# EAGLE schematic p8x-regbank-card (EAGLE 9.6.2)
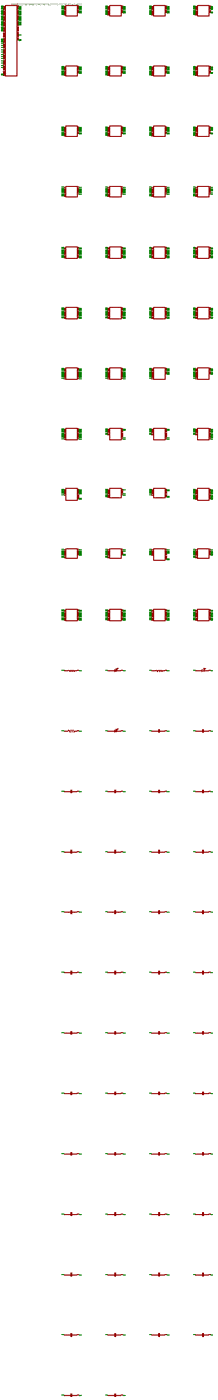
[diagram p0: schematic, sheet 1, overview]
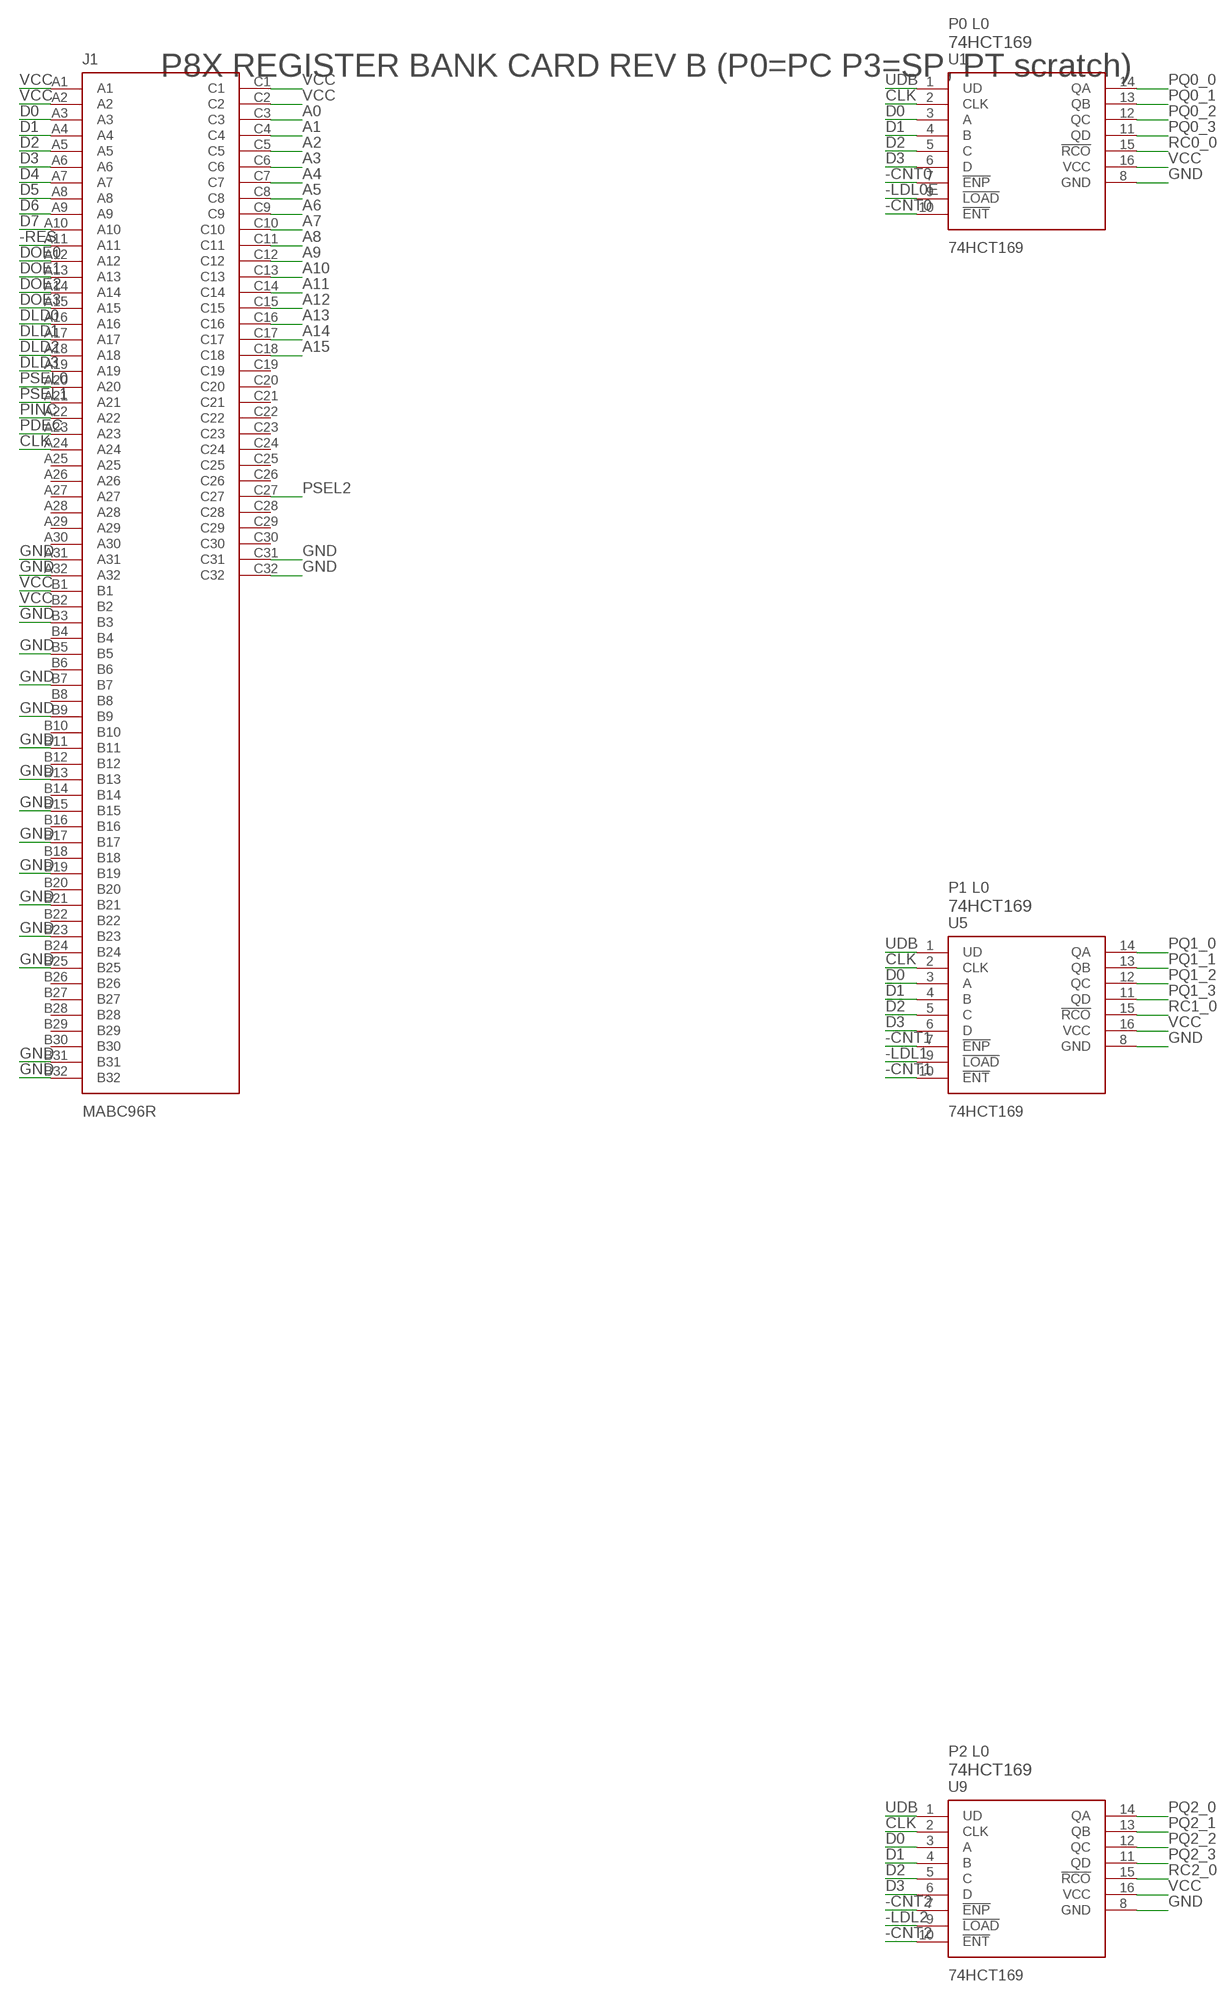
[diagram p1: schematic, sheet 1, part 1 of 9]
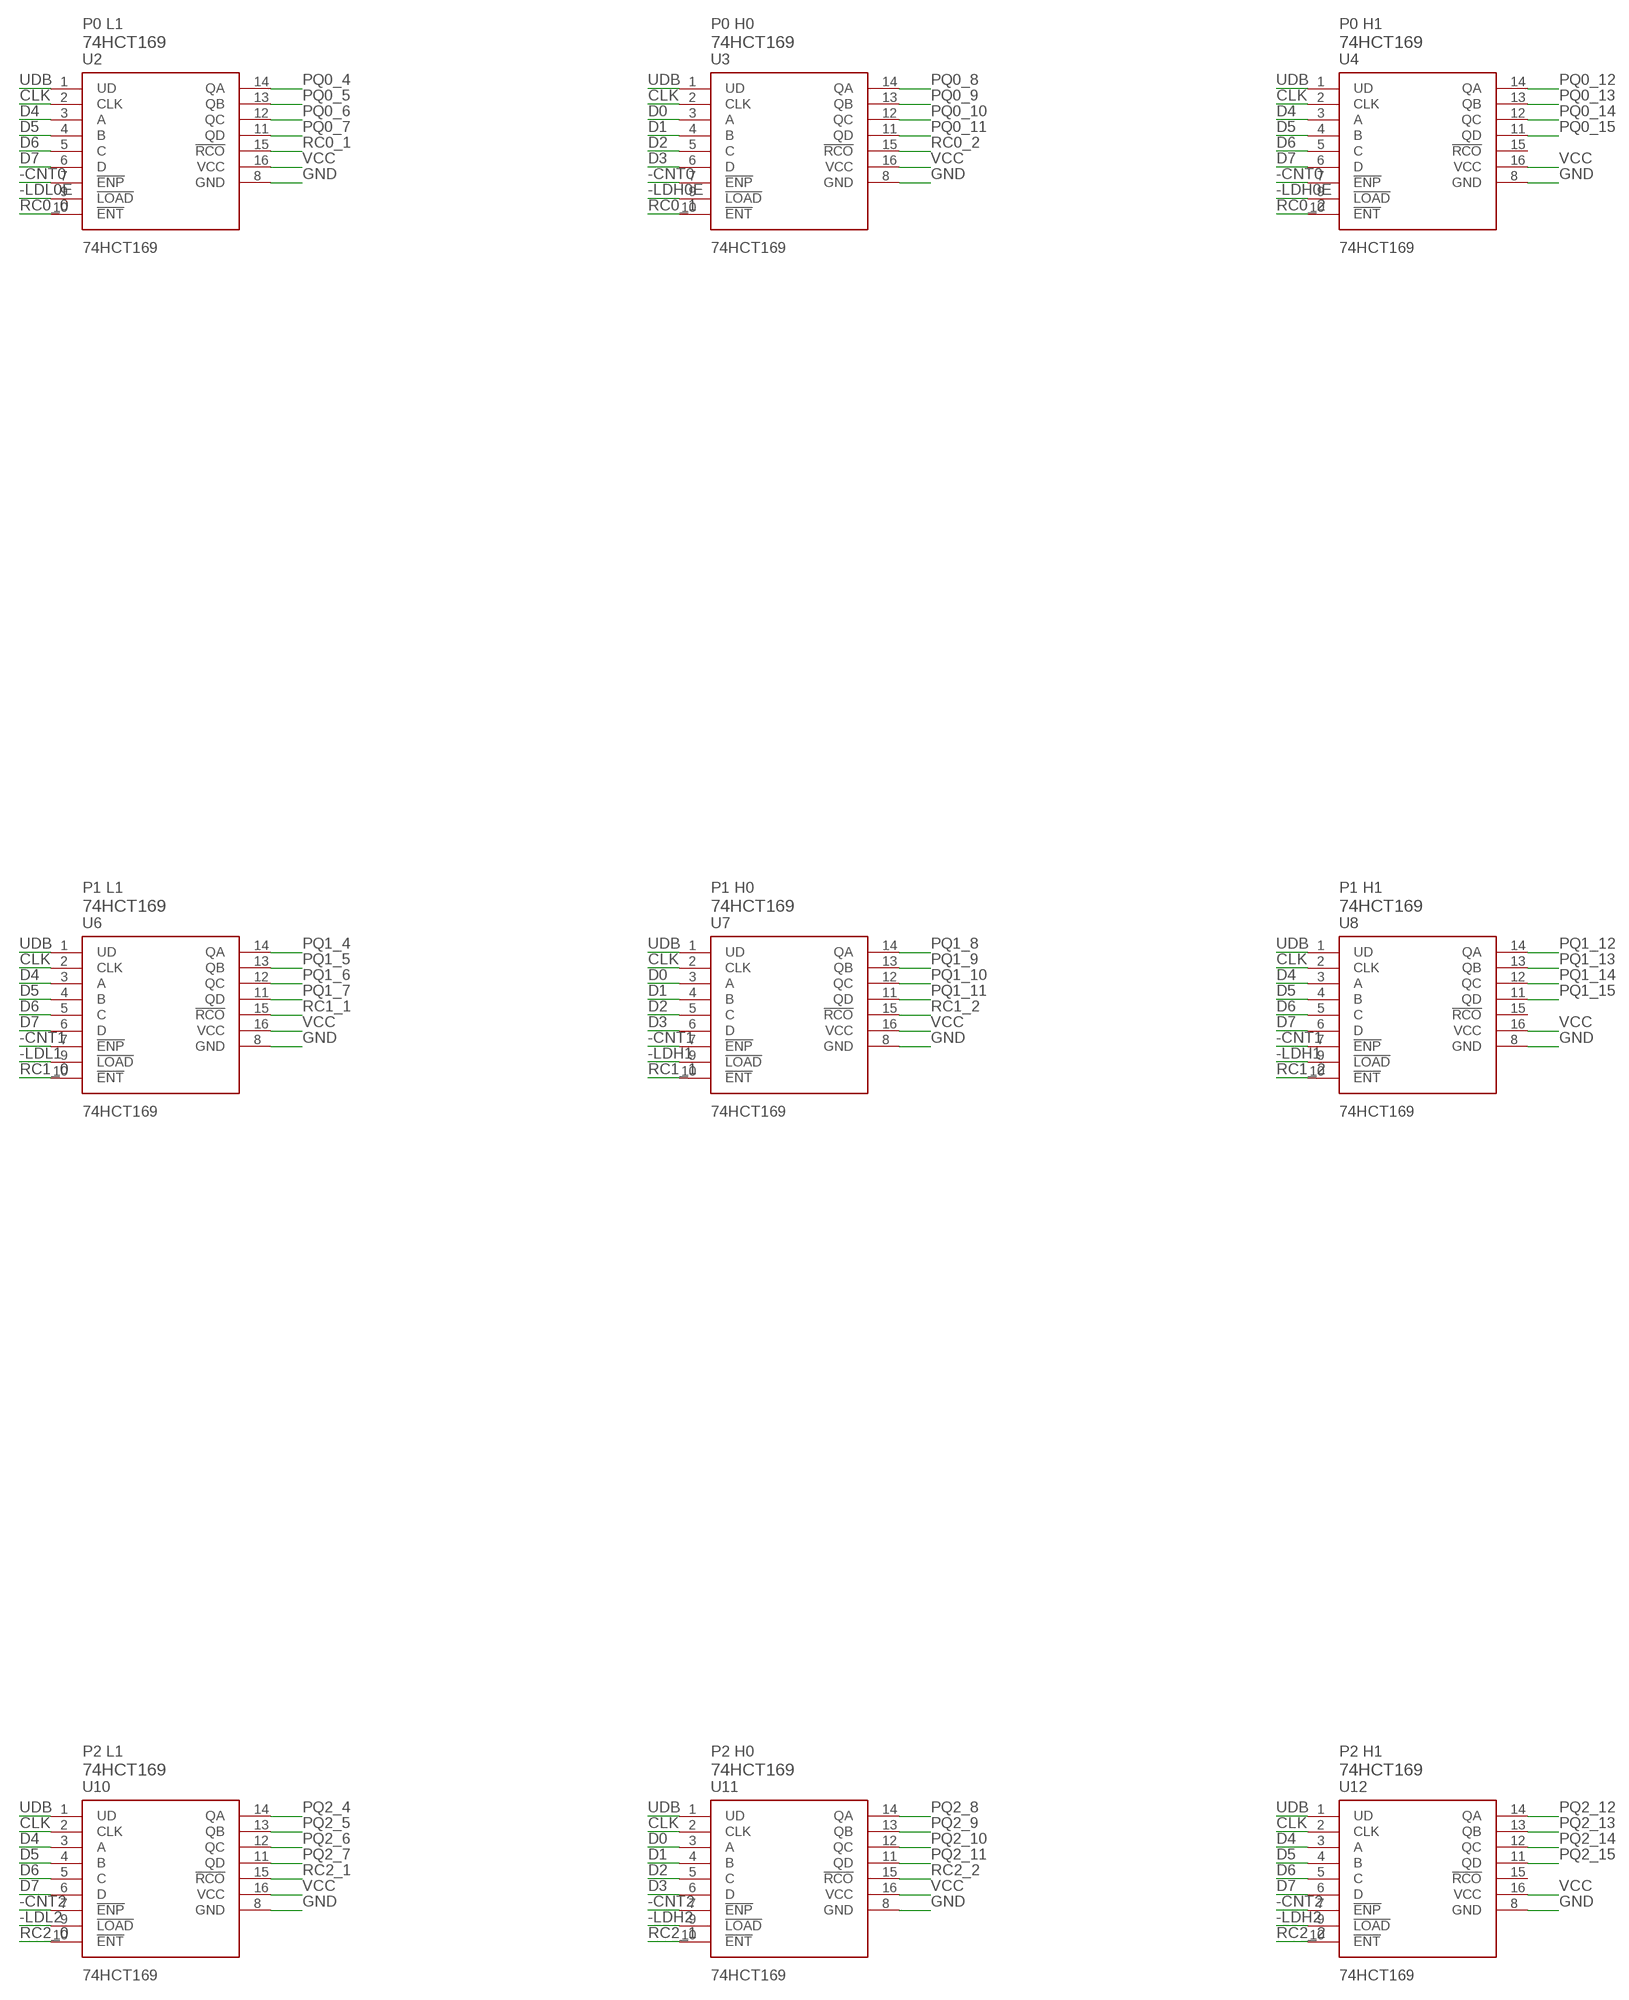
[diagram p2: schematic, sheet 1, part 2 of 9]
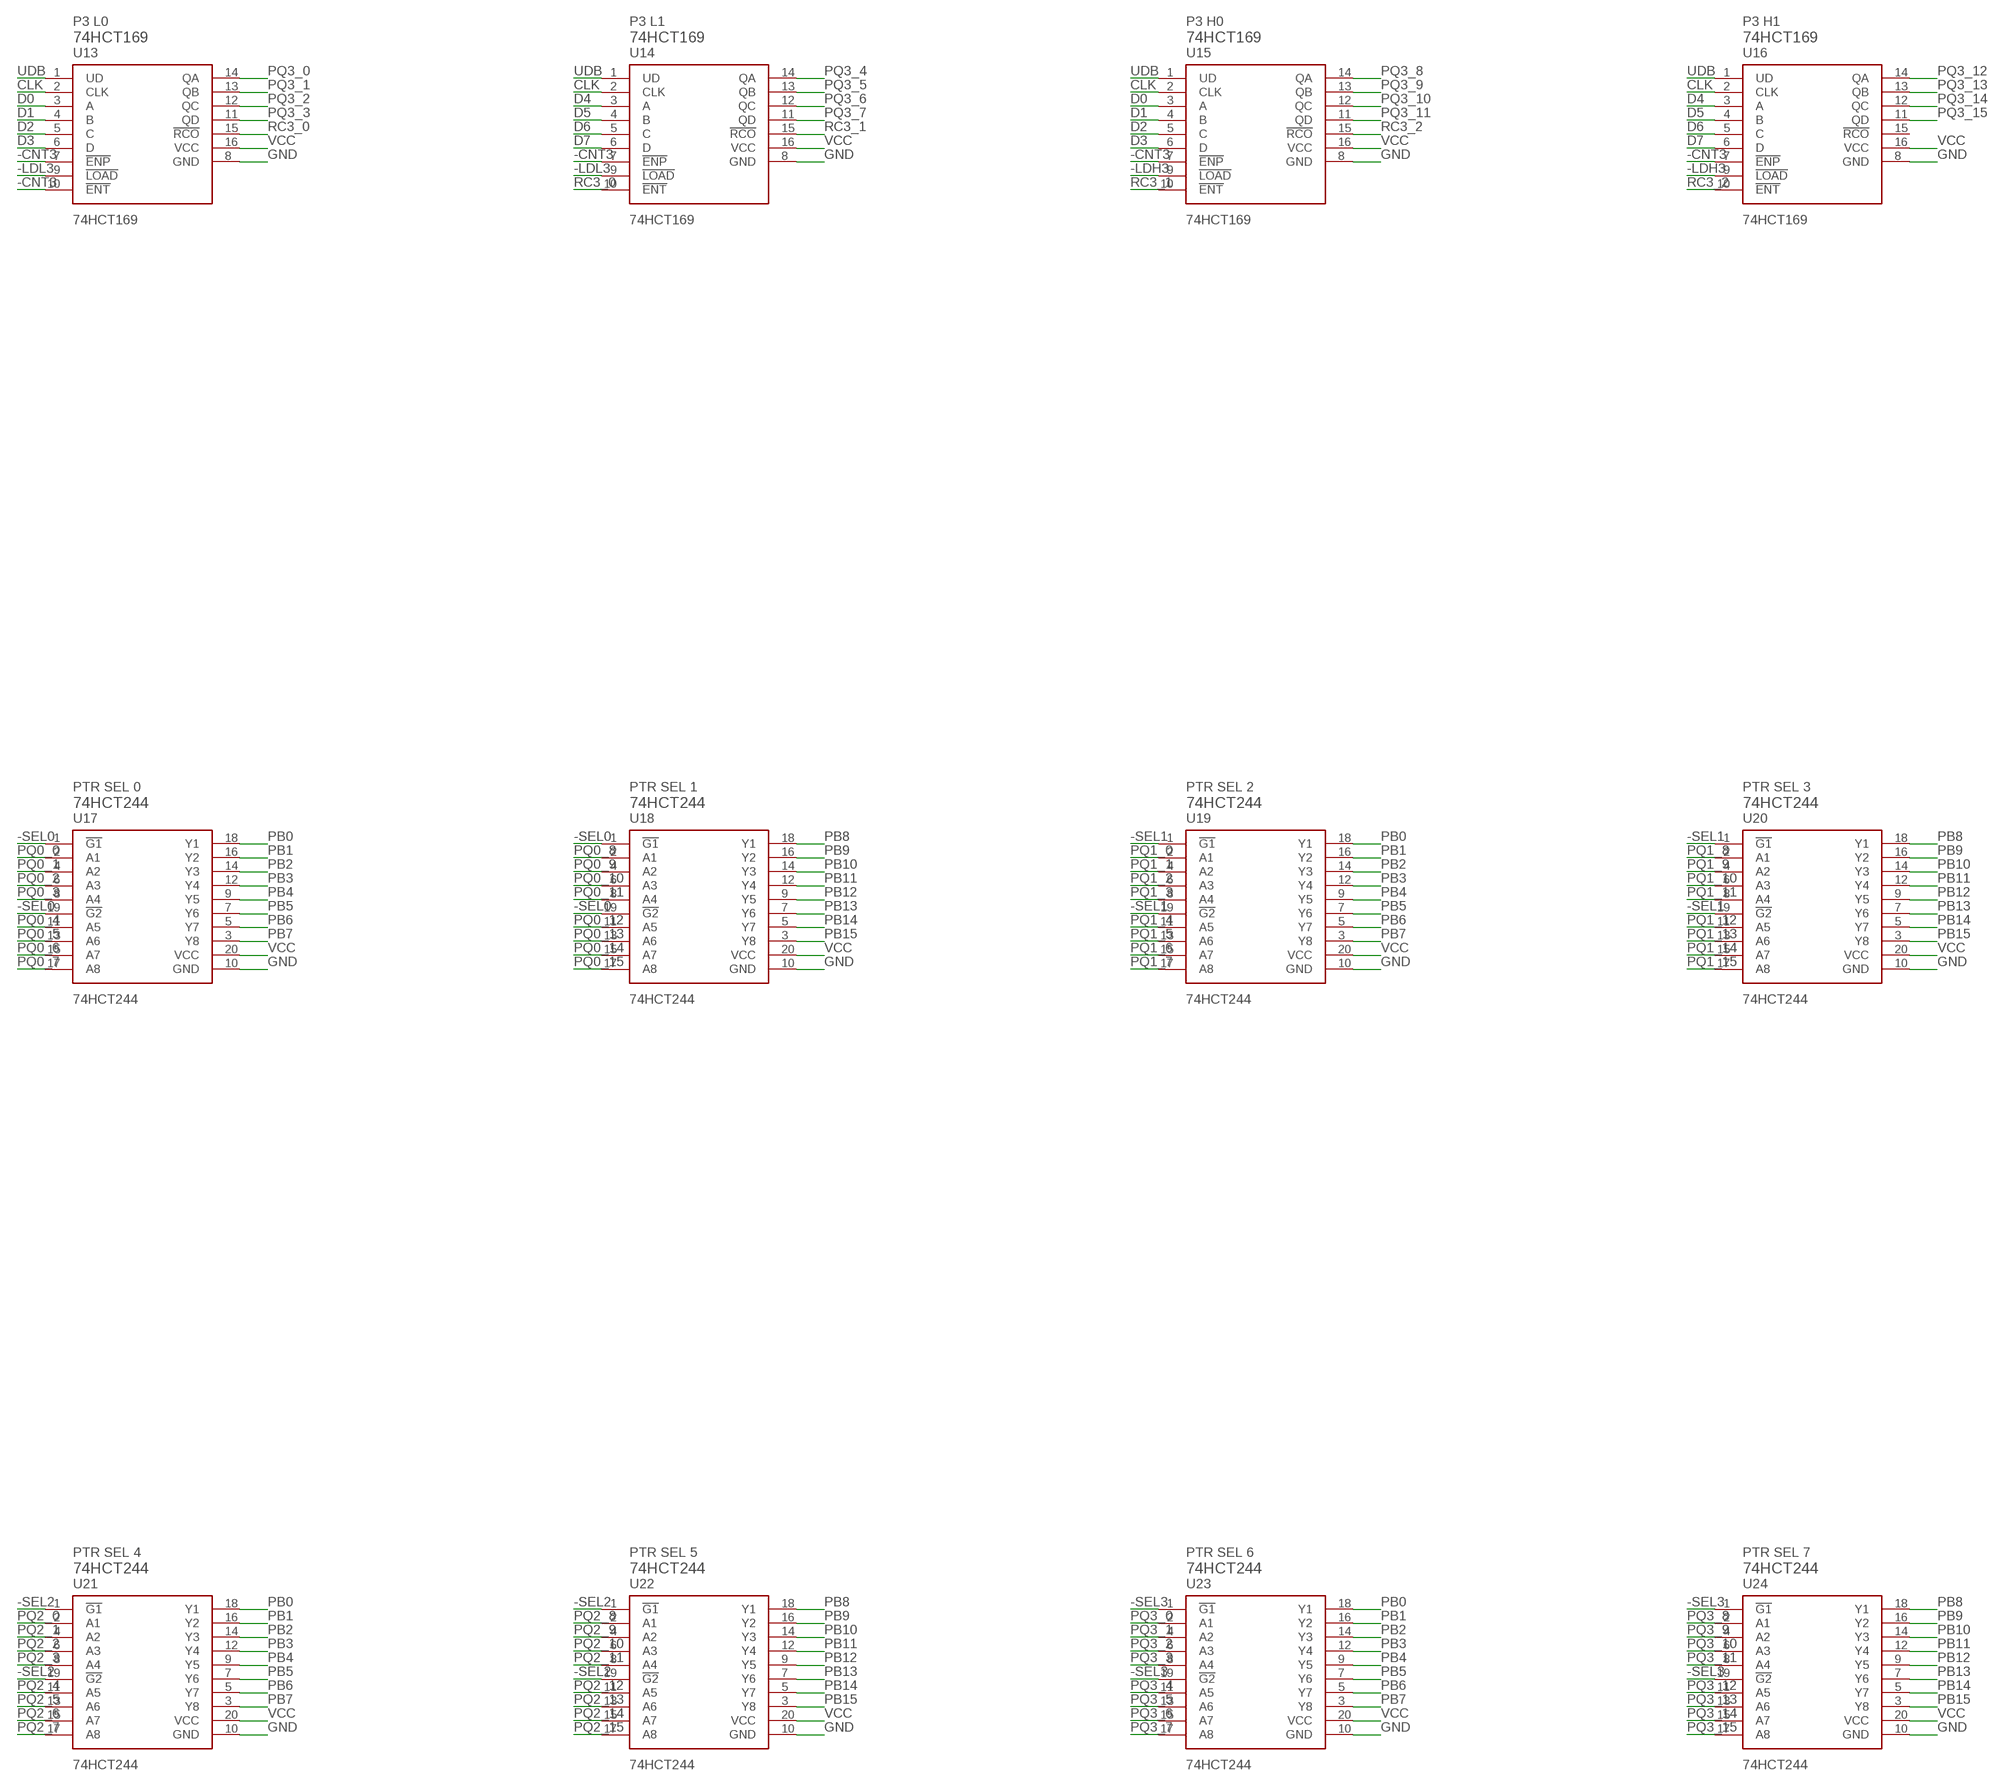
[diagram p3: schematic, sheet 1, part 3 of 9]
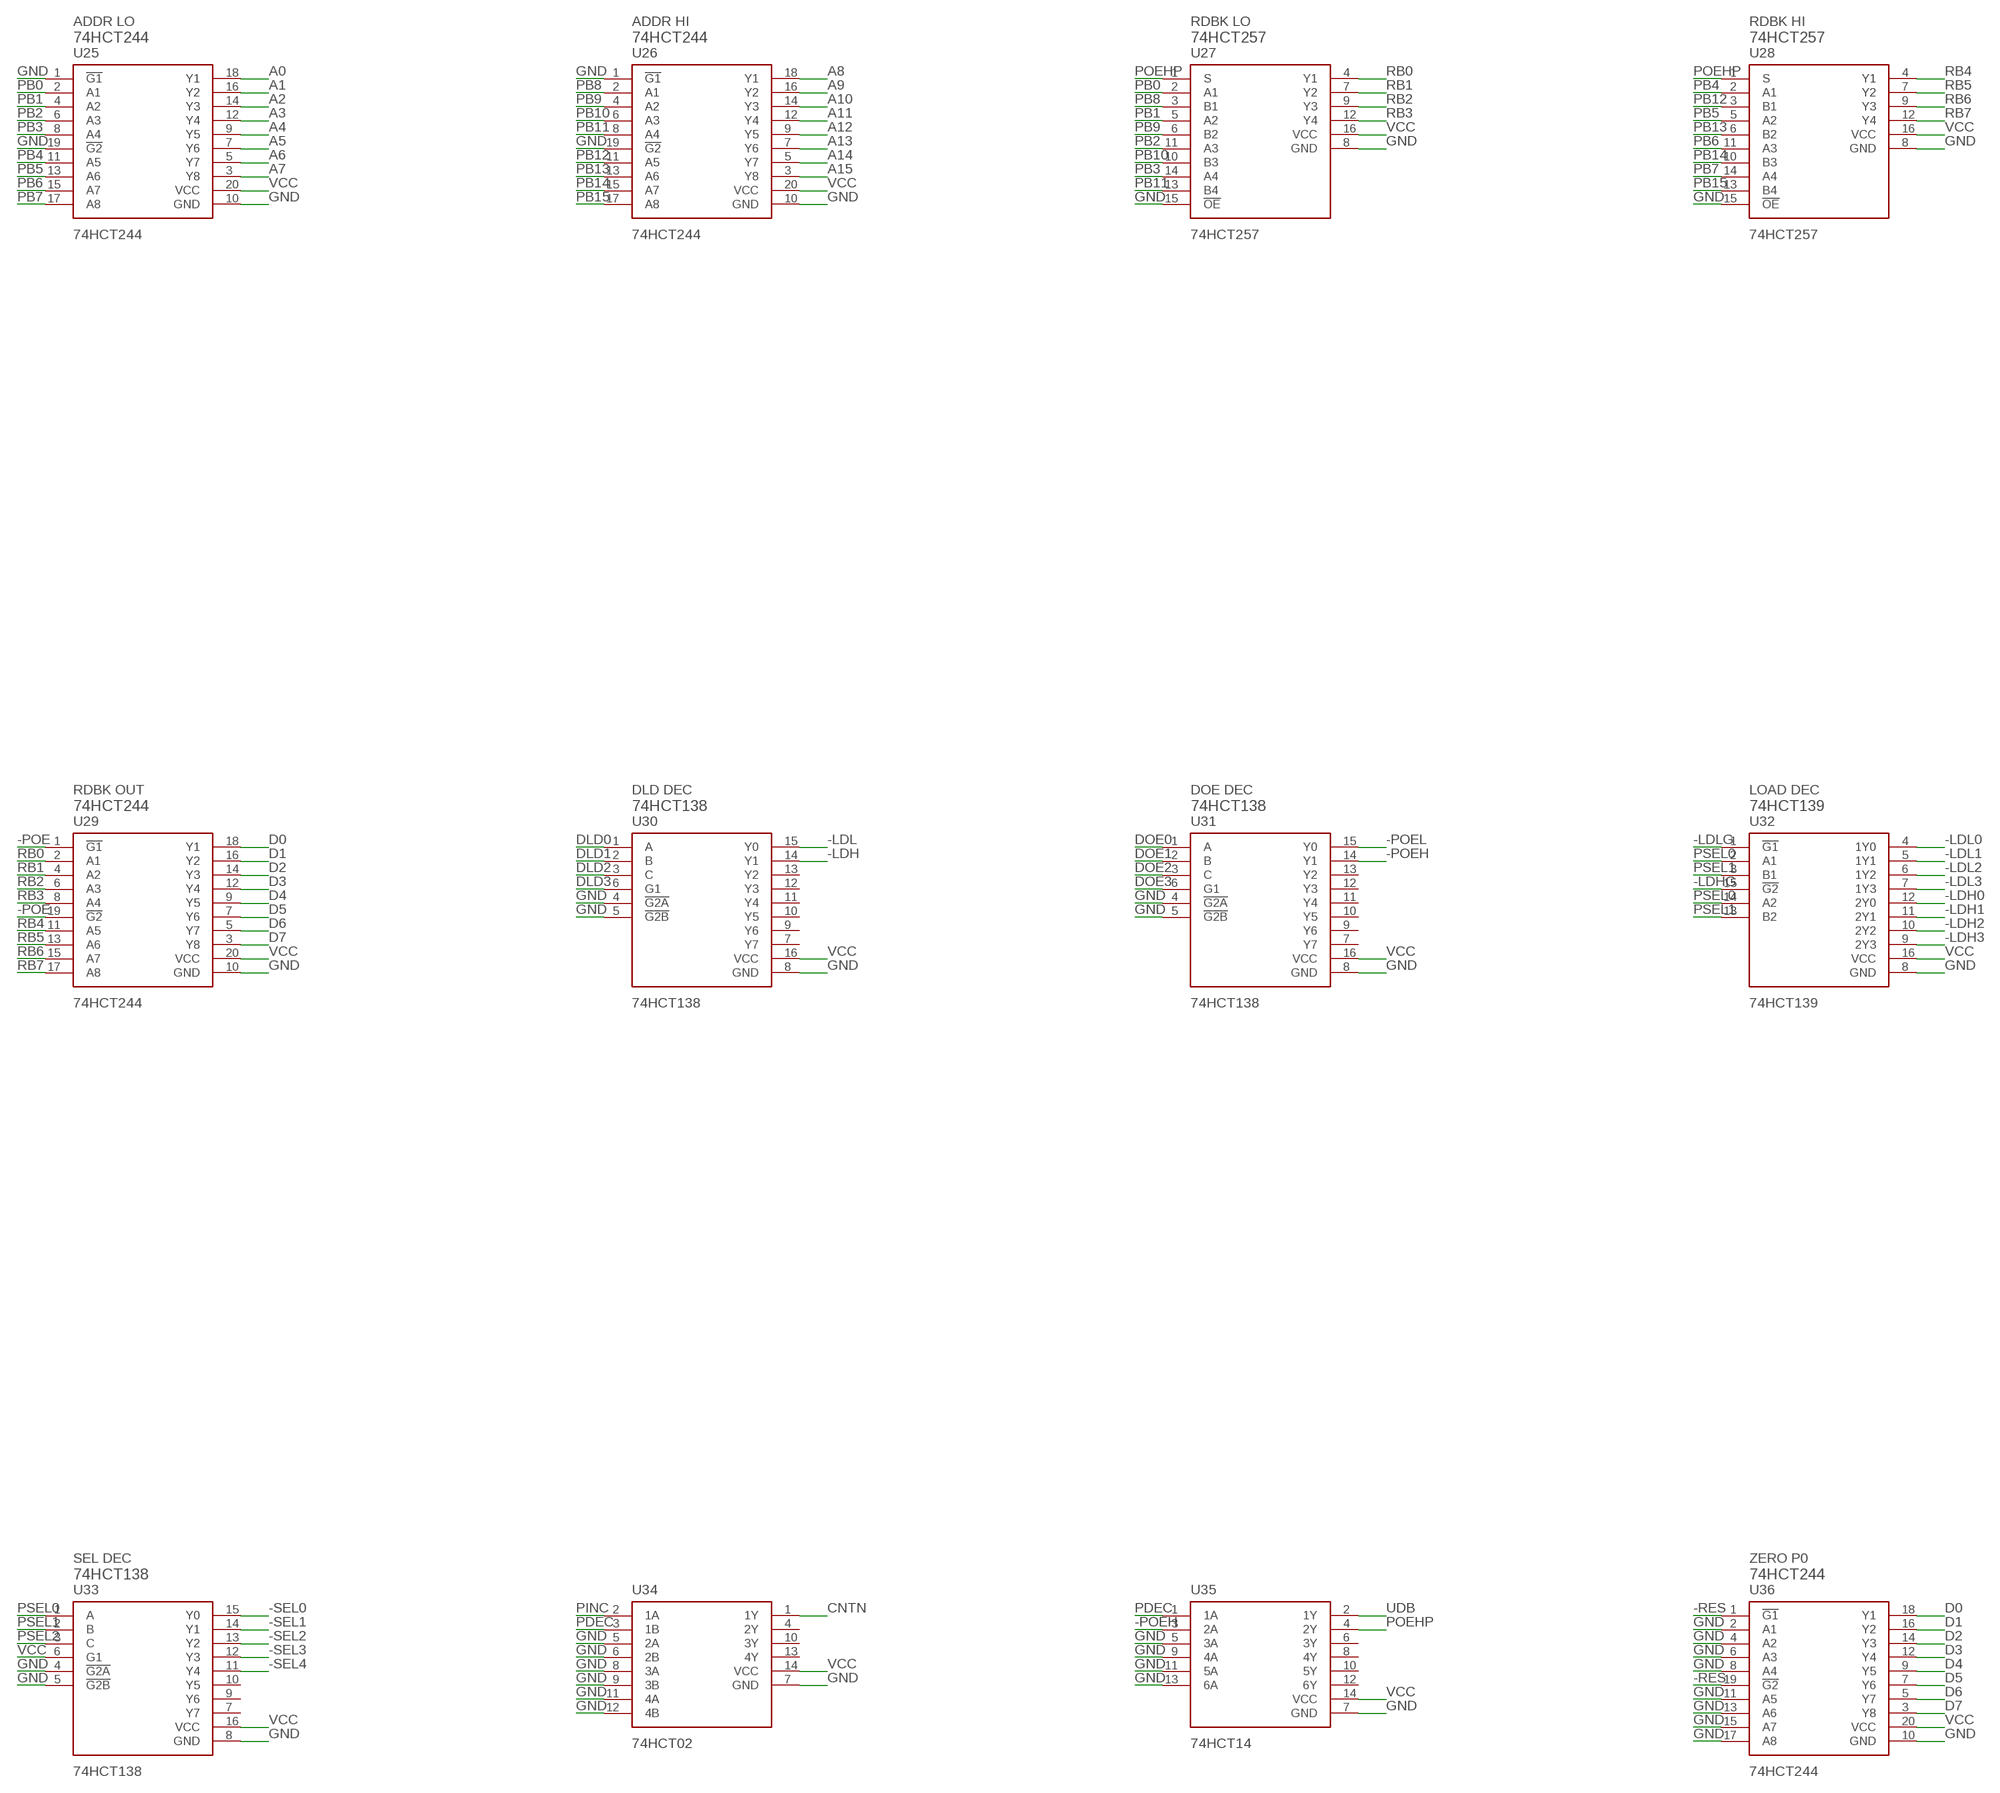
[diagram p4: schematic, sheet 1, part 4 of 9]
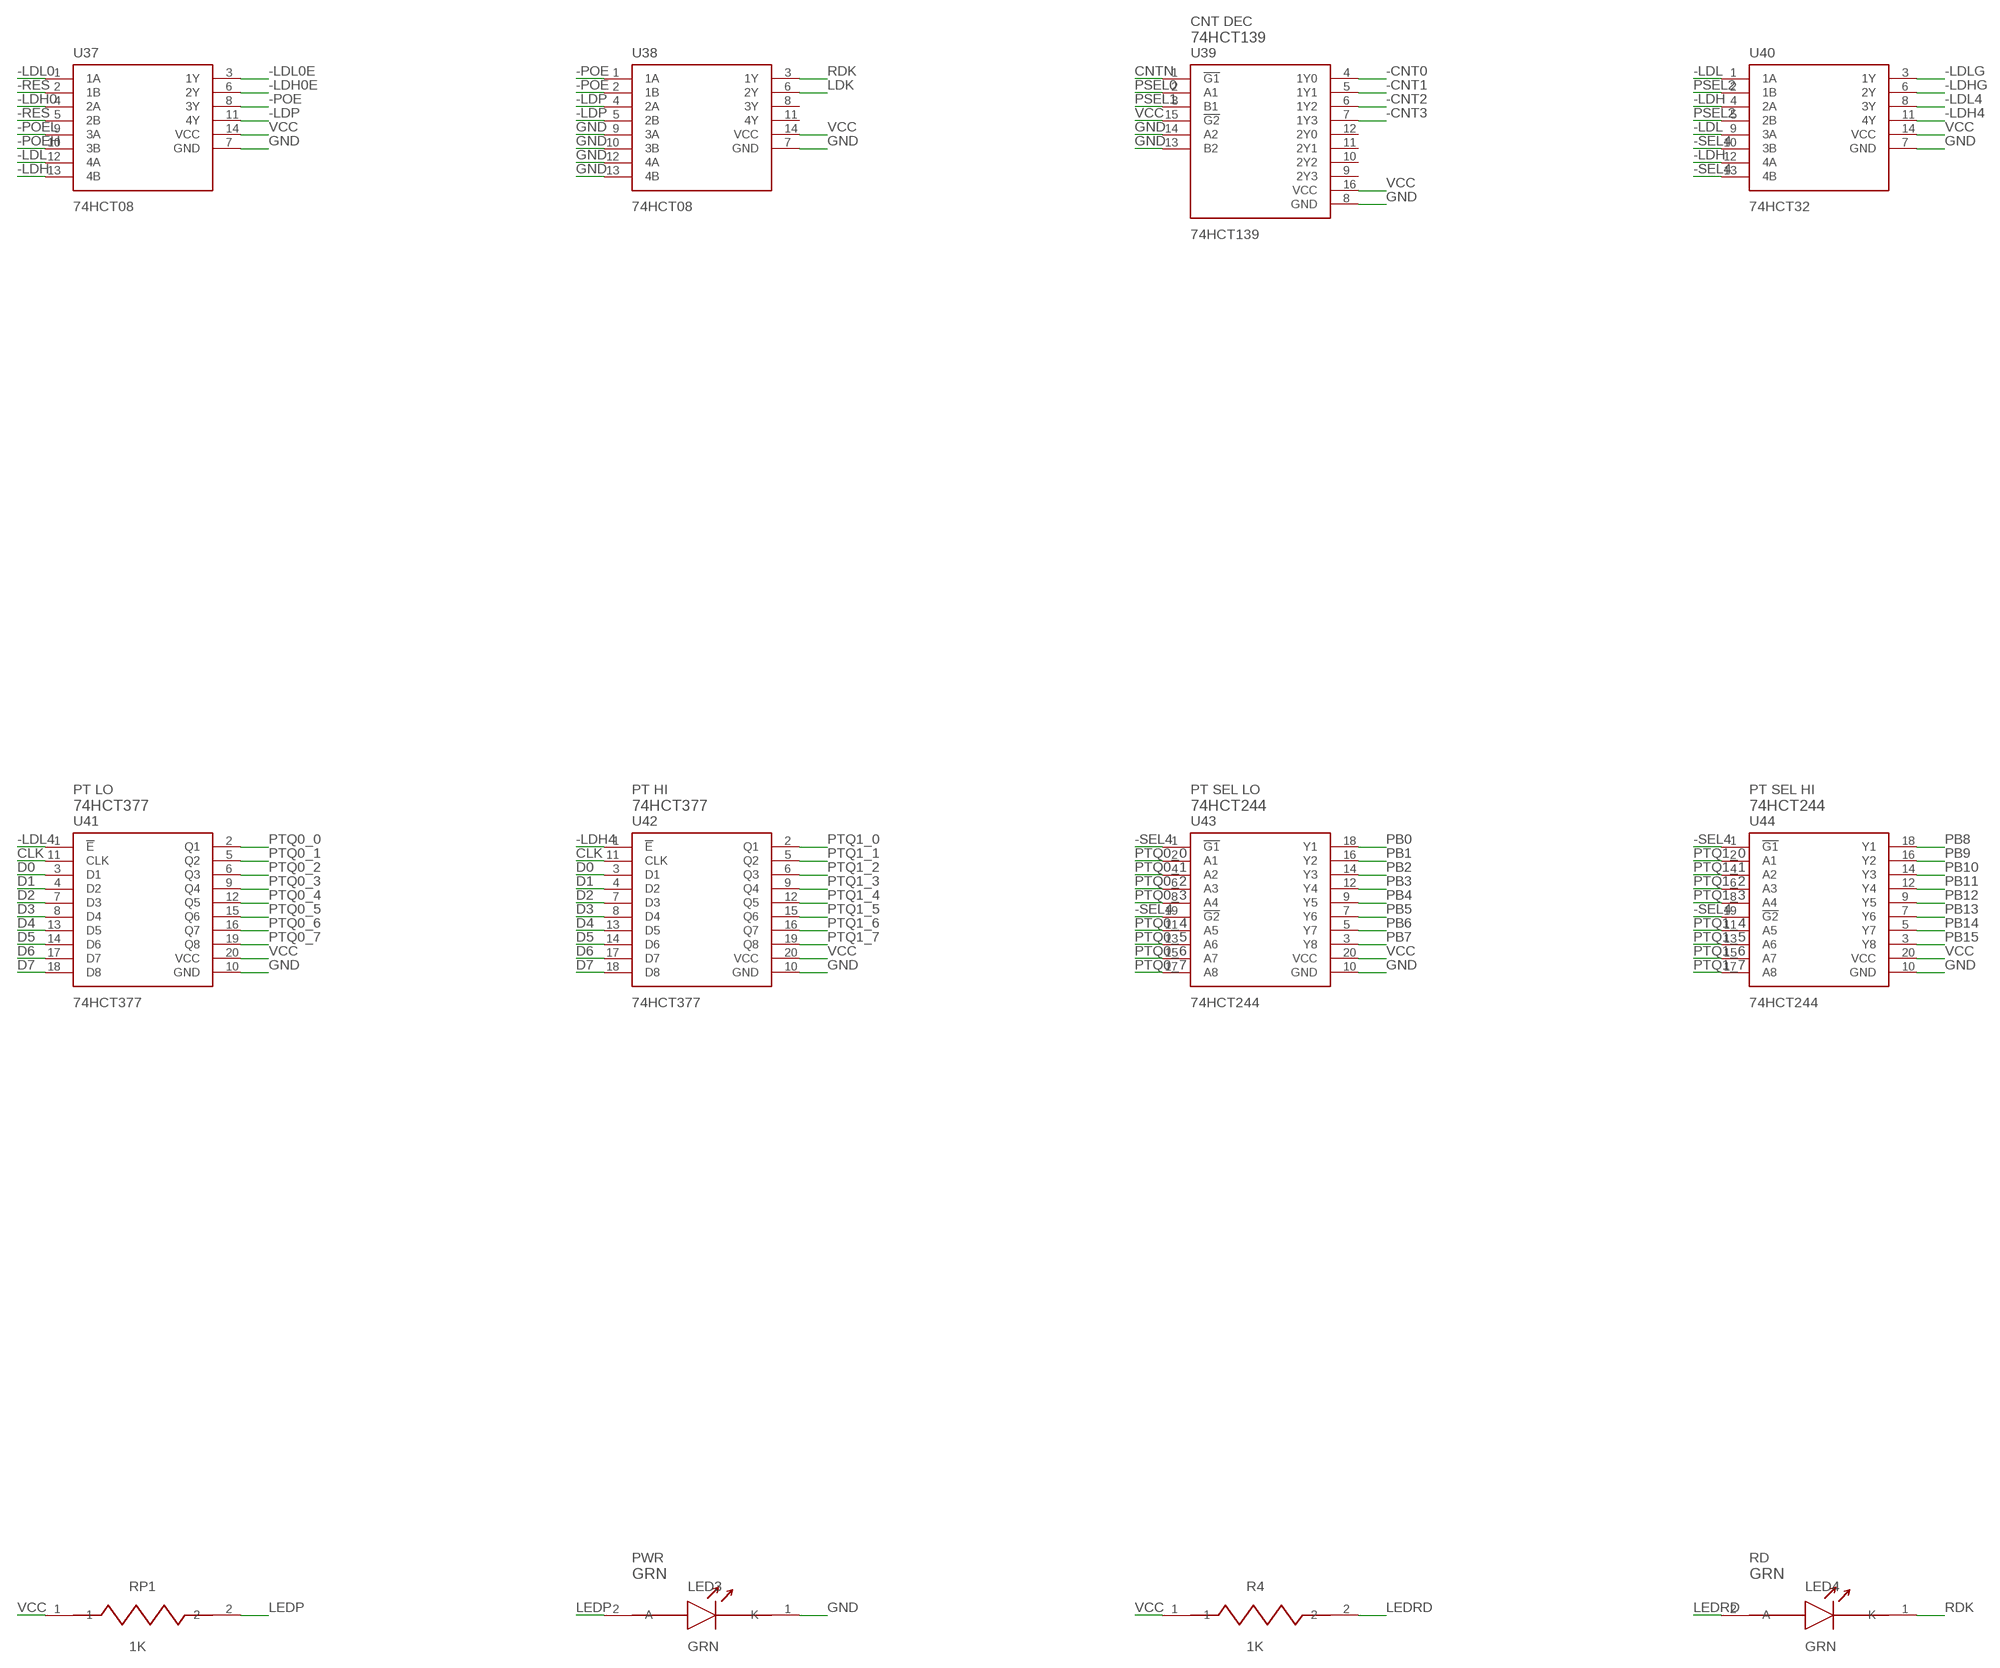
[diagram p5: schematic, sheet 1, part 5 of 9]
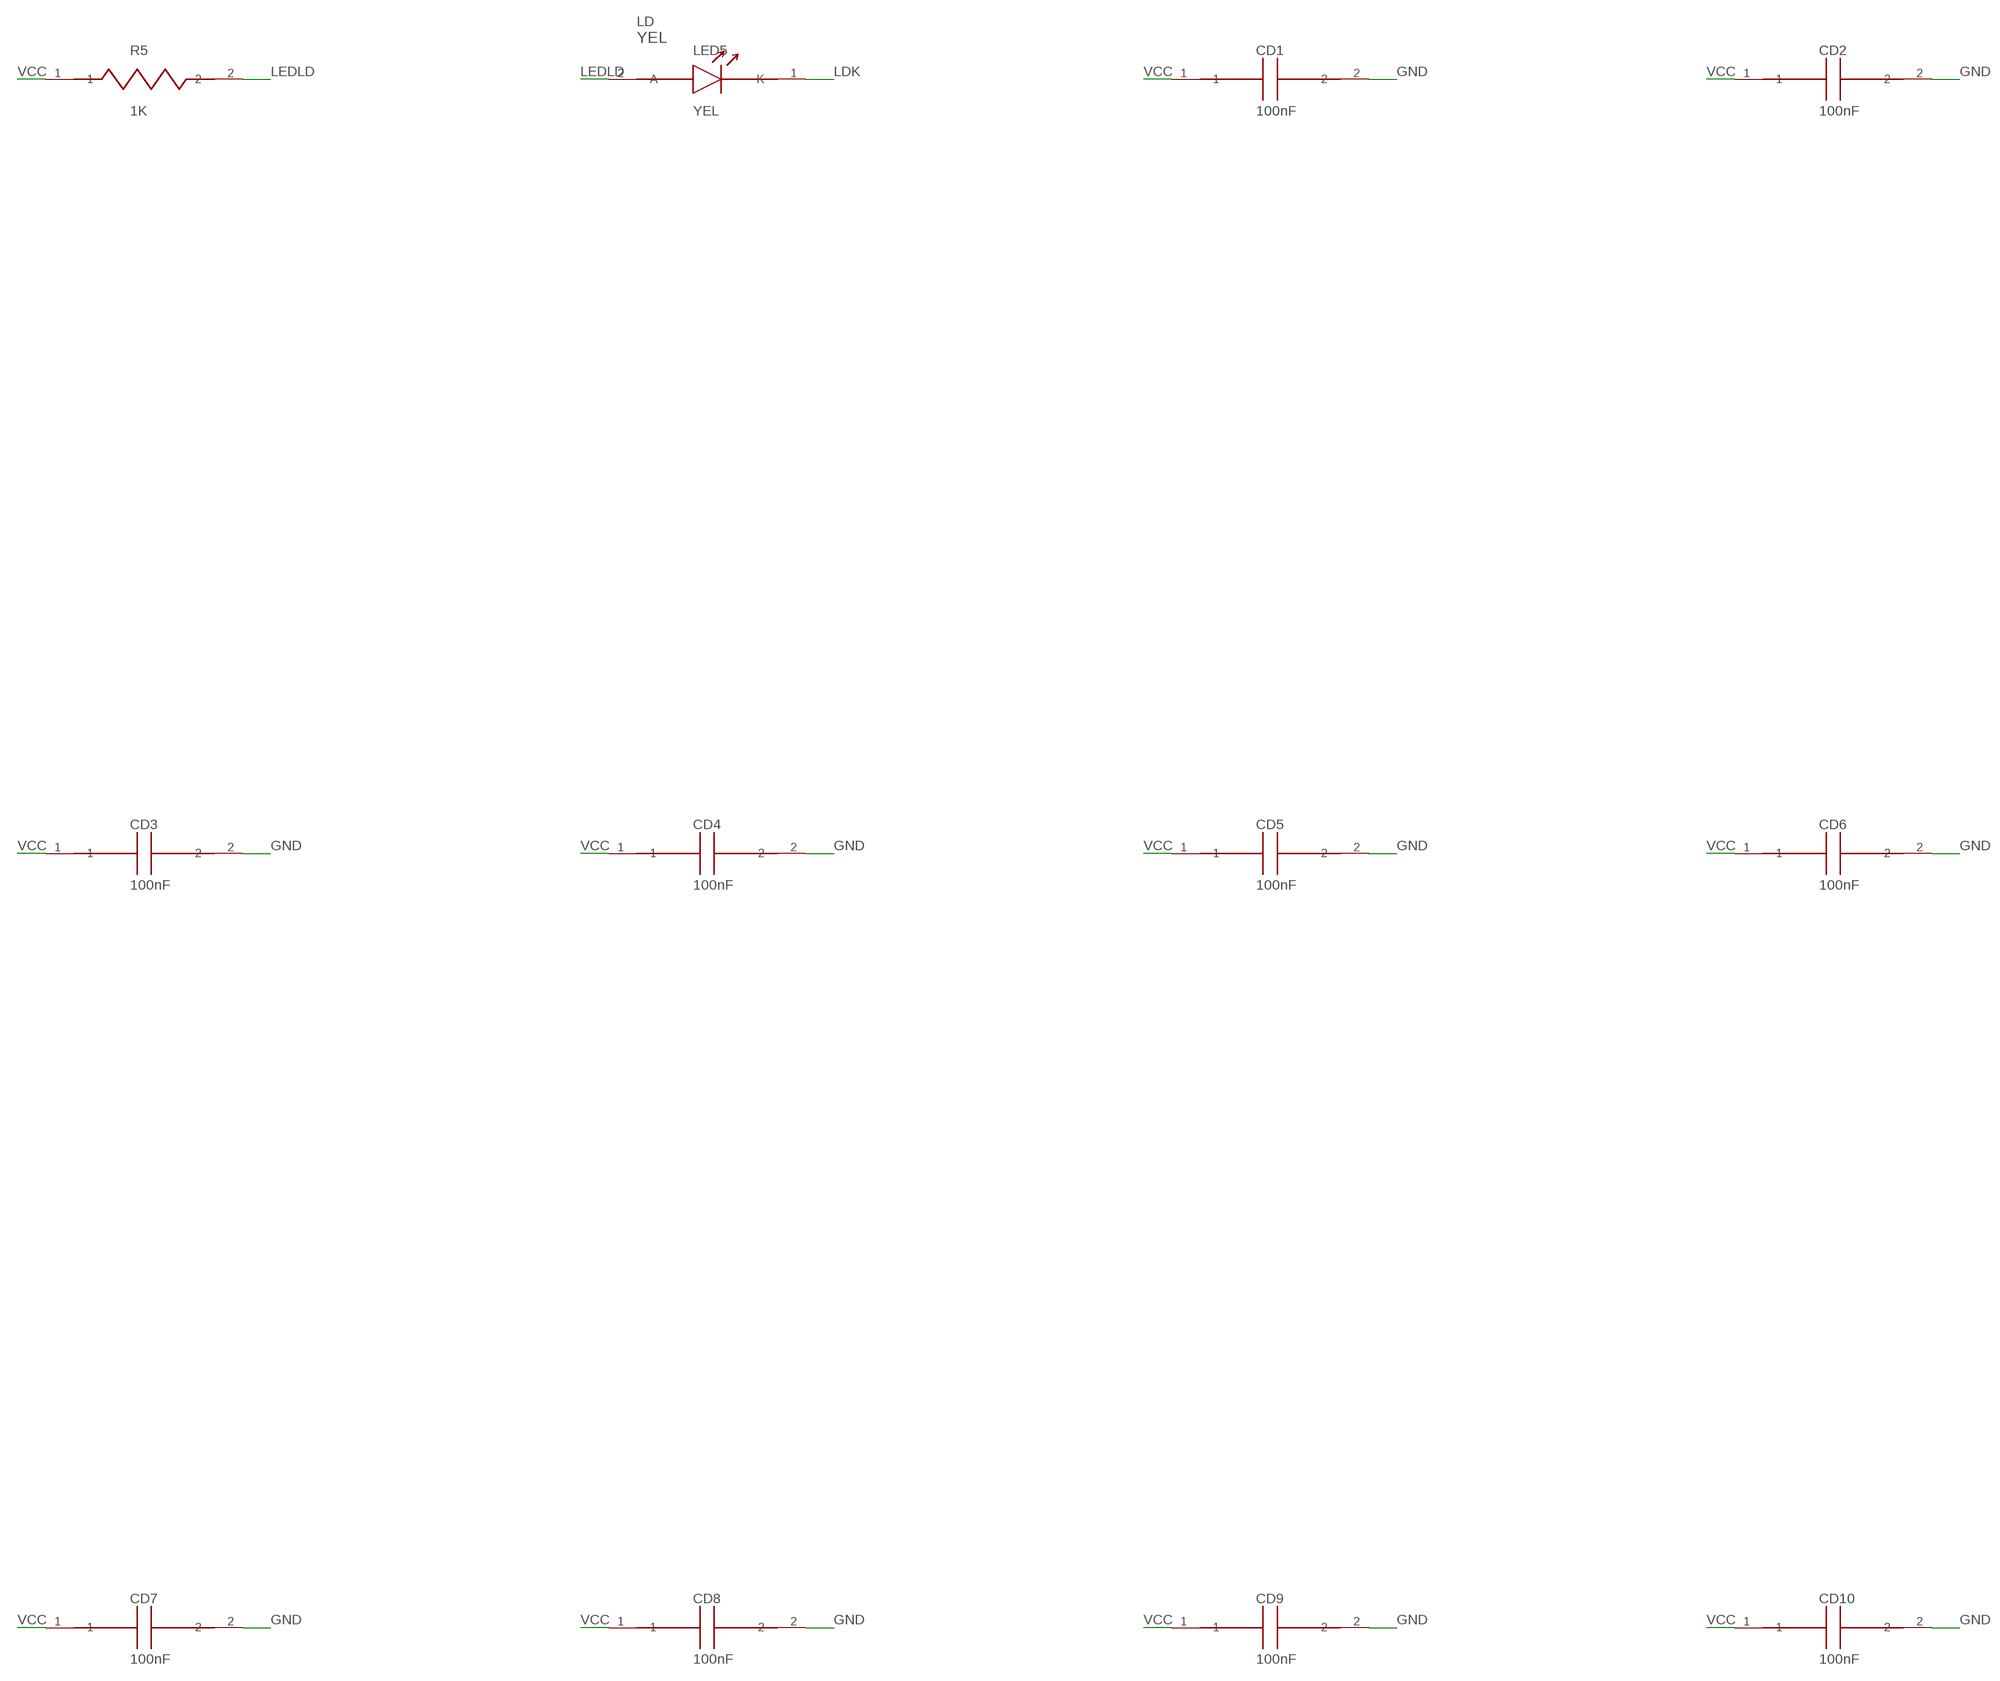
[diagram p6: schematic, sheet 1, part 6 of 9]
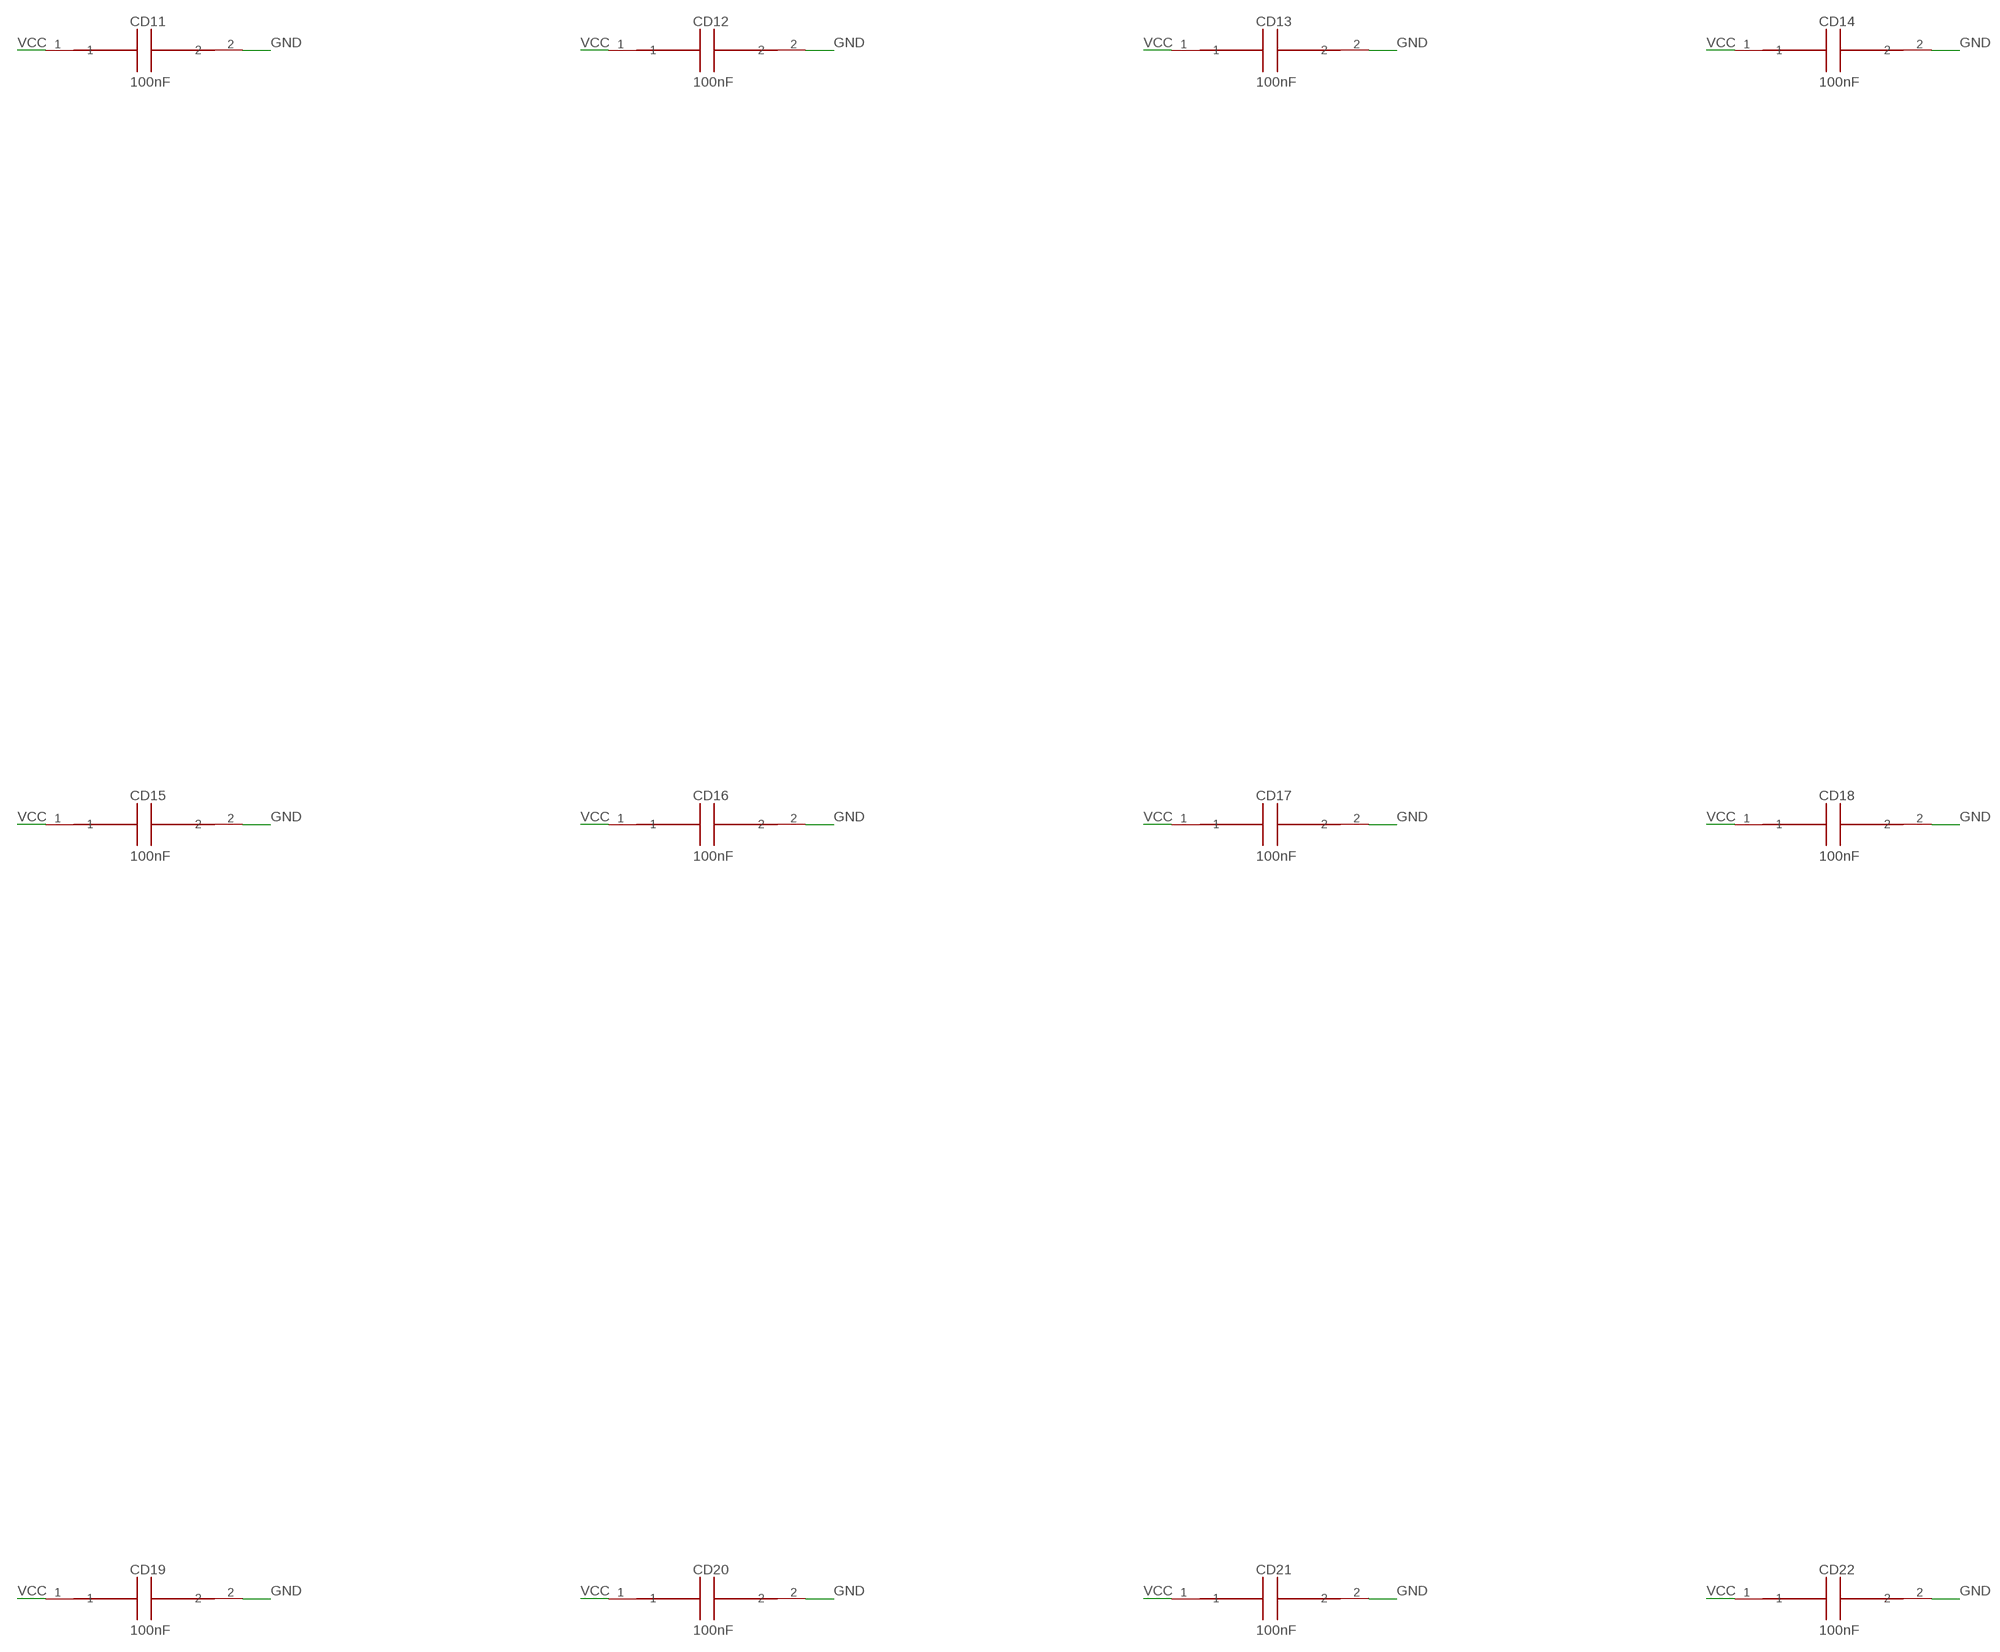
[diagram p7: schematic, sheet 1, part 7 of 9]
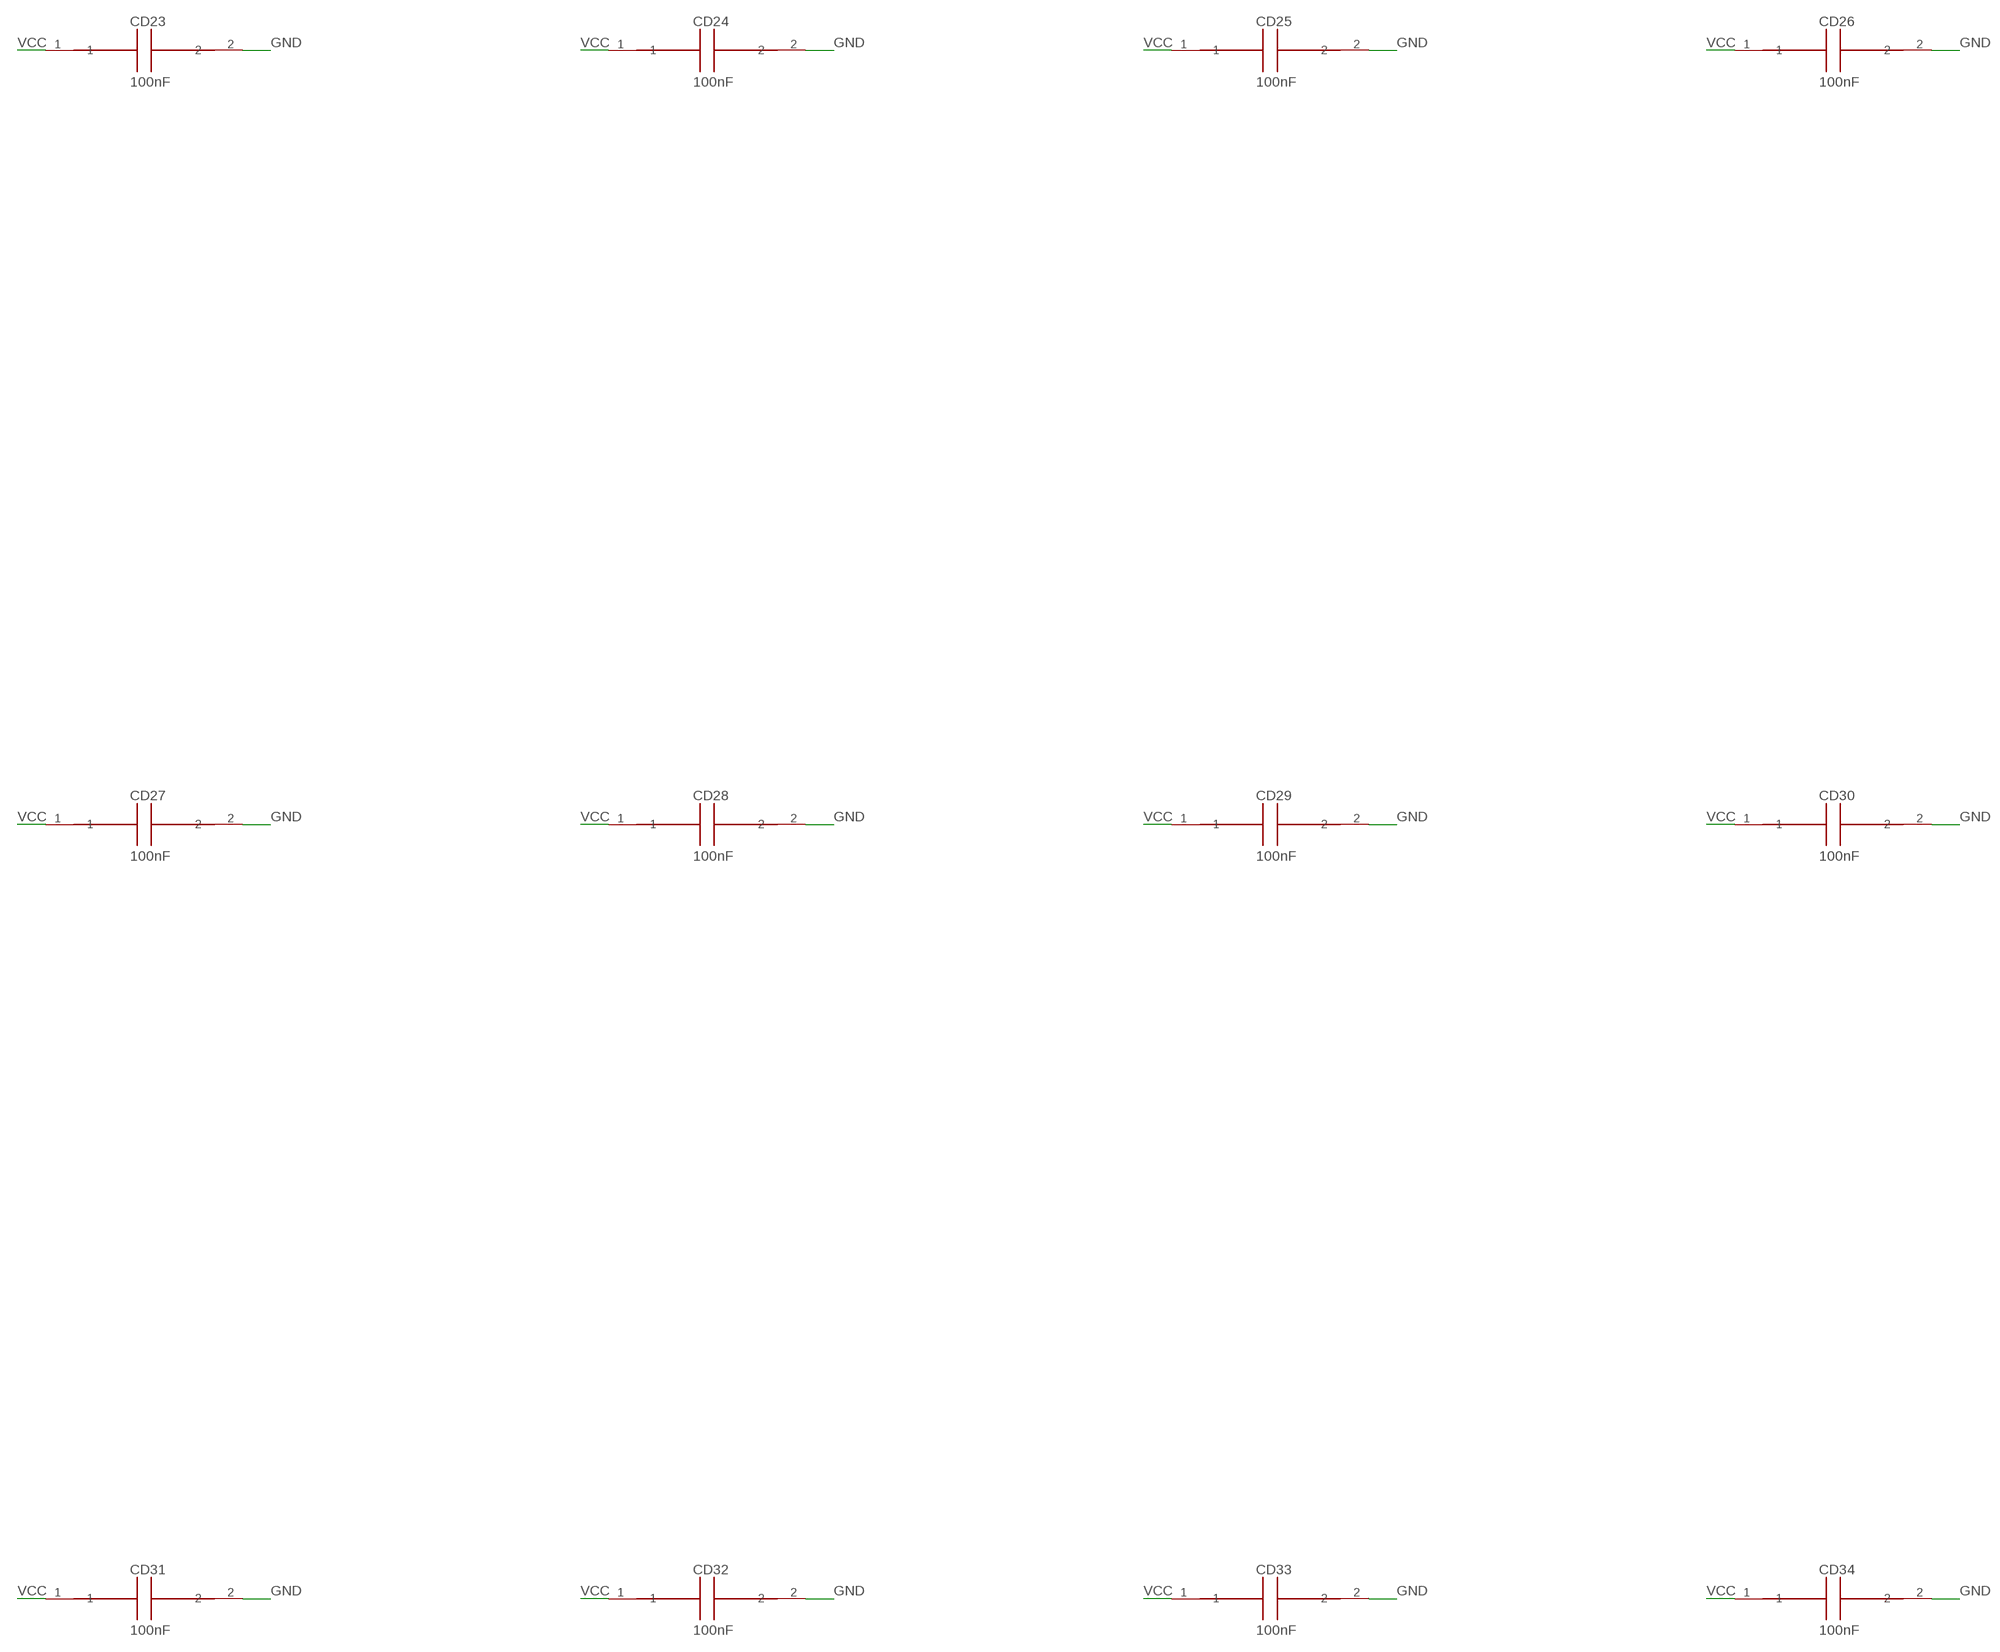
[diagram p8: schematic, sheet 1, part 8 of 9]
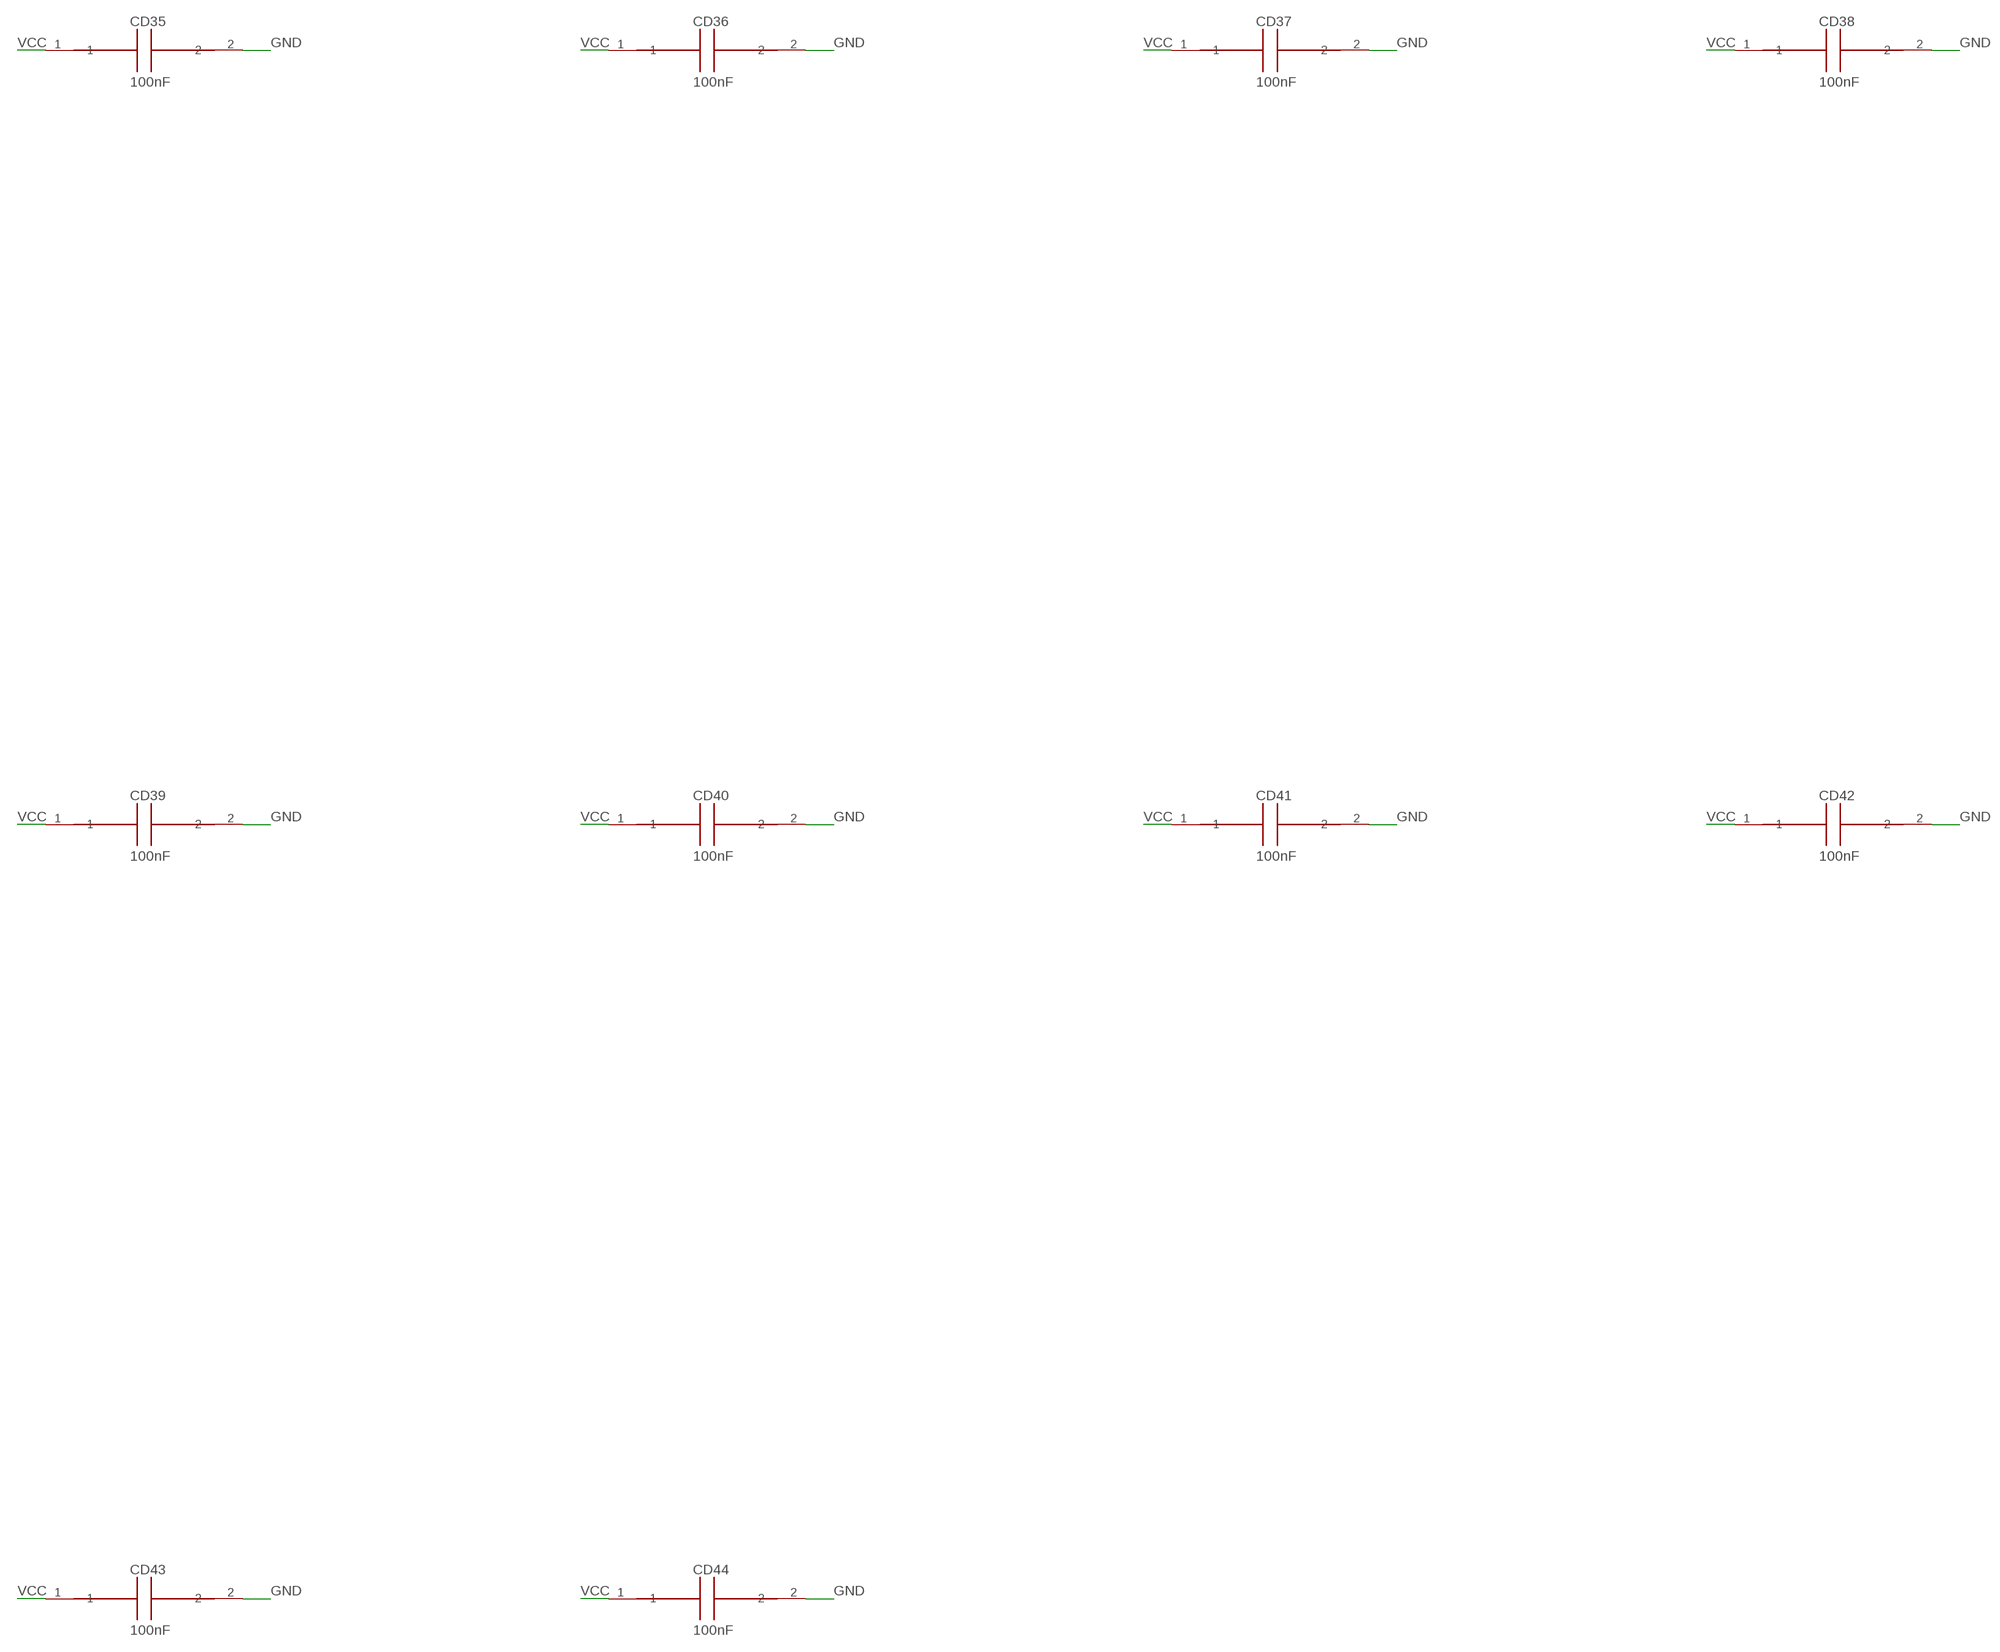
[diagram p9: schematic, sheet 1, part 9 of 9]

## Parts
CD1  100nF  CAP1  [C_DISC1]
CD2  100nF  CAP1  [C_DISC1]
CD3  100nF  CAP1  [C_DISC1]
CD4  100nF  CAP1  [C_DISC1]
CD5  100nF  CAP1  [C_DISC1]
CD6  100nF  CAP1  [C_DISC1]
CD7  100nF  CAP1  [C_DISC1]
CD8  100nF  CAP1  [C_DISC1]
CD9  100nF  CAP1  [C_DISC1]
CD10  100nF  CAP1  [C_DISC1]
CD11  100nF  CAP1  [C_DISC1]
CD12  100nF  CAP1  [C_DISC1]
CD13  100nF  CAP1  [C_DISC1]
CD14  100nF  CAP1  [C_DISC1]
CD15  100nF  CAP1  [C_DISC1]
CD16  100nF  CAP1  [C_DISC1]
CD17  100nF  CAP1  [C_DISC1]
CD18  100nF  CAP1  [C_DISC1]
CD19  100nF  CAP1  [C_DISC1]
CD20  100nF  CAP1  [C_DISC1]
CD21  100nF  CAP1  [C_DISC1]
CD22  100nF  CAP1  [C_DISC1]
CD23  100nF  CAP1  [C_DISC1]
CD24  100nF  CAP1  [C_DISC1]
CD25  100nF  CAP1  [C_DISC1]
CD26  100nF  CAP1  [C_DISC1]
CD27  100nF  CAP1  [C_DISC1]
CD28  100nF  CAP1  [C_DISC1]
CD29  100nF  CAP1  [C_DISC1]
CD30  100nF  CAP1  [C_DISC1]
CD31  100nF  CAP1  [C_DISC1]
CD32  100nF  CAP1  [C_DISC1]
CD33  100nF  CAP1  [C_DISC1]
CD34  100nF  CAP1  [C_DISC1]
CD35  100nF  CAP1  [C_DISC1]
CD36  100nF  CAP1  [C_DISC1]
CD37  100nF  CAP1  [C_DISC1]
CD38  100nF  CAP1  [C_DISC1]
CD39  100nF  CAP1  [C_DISC1]
CD40  100nF  CAP1  [C_DISC1]
CD41  100nF  CAP1  [C_DISC1]
CD42  100nF  CAP1  [C_DISC1]
CD43  100nF  CAP1  [C_DISC1]
CD44  100nF  CAP1  [C_DISC1]
J1  MABC96R  DIN96C  [MABC96R]
LED3  GRN  LED  [LED5]
LED4  GRN  LED  [LED5]
LED5  YEL  LED  [LED5]
R4  1K  RES  [R_AXIAL]
R5  1K  RES  [R_AXIAL]
RP1  1K  RES  [R_AXIAL]
U1  74HCT169  74169  [DIP16]
U2  74HCT169  74169  [DIP16]
U3  74HCT169  74169  [DIP16]
U4  74HCT169  74169  [DIP16]
U5  74HCT169  74169  [DIP16]
U6  74HCT169  74169  [DIP16]
U7  74HCT169  74169  [DIP16]
U8  74HCT169  74169  [DIP16]
U9  74HCT169  74169  [DIP16]
U10  74HCT169  74169  [DIP16]
U11  74HCT169  74169  [DIP16]
U12  74HCT169  74169  [DIP16]
U13  74HCT169  74169  [DIP16]
U14  74HCT169  74169  [DIP16]
U15  74HCT169  74169  [DIP16]
U16  74HCT169  74169  [DIP16]
U17  74HCT244  74244  [DIP20]
U18  74HCT244  74244  [DIP20]
U19  74HCT244  74244  [DIP20]
U20  74HCT244  74244  [DIP20]
U21  74HCT244  74244  [DIP20]
U22  74HCT244  74244  [DIP20]
U23  74HCT244  74244  [DIP20]
U24  74HCT244  74244  [DIP20]
U25  74HCT244  74244  [DIP20]
U26  74HCT244  74244  [DIP20]
U27  74HCT257  74257  [DIP16]
U28  74HCT257  74257  [DIP16]
U29  74HCT244  74244  [DIP20]
U30  74HCT138  74138  [DIP16]
U31  74HCT138  74138  [DIP16]
U32  74HCT139  74139  [DIP16]
U33  74HCT138  74138  [DIP16]
U34  74HCT02  7402  [DIP14]
U35  74HCT14  HEX14  [DIP14]
U36  74HCT244  74244  [DIP20]
U37  74HCT08  GATES14  [DIP14]
U38  74HCT08  GATES14  [DIP14]
U39  74HCT139  74139  [DIP16]
U40  74HCT32  GATES14  [DIP14]
U41  74HCT377  74377V2  [DIP20]
U42  74HCT377  74377V2  [DIP20]
U43  74HCT244  74244  [DIP20]
U44  74HCT244  74244  [DIP20]

## Nets
-CNT0: U1.7(!ENP) U1.10(!ENT) U2.7(!ENP) U3.7(!ENP) U4.7(!ENP) U39.4(1Y0)
-CNT1: U5.7(!ENP) U5.10(!ENT) U6.7(!ENP) U7.7(!ENP) U8.7(!ENP) U39.5(1Y1)
-CNT2: U9.7(!ENP) U9.10(!ENT) U10.7(!ENP) U11.7(!ENP) U12.7(!ENP) U39.6(1Y2)
-CNT3: U13.7(!ENP) U13.10(!ENT) U14.7(!ENP) U15.7(!ENP) U16.7(!ENP) U39.7(1Y3)
-LDH: U30.14(Y1) U37.13(4B) U40.4(2A) U40.12(4A)
-LDH0: U32.12(2Y0) U37.4(2A)
-LDH0E: U3.9(!LOAD) U4.9(!LOAD) U37.6(2Y)
-LDH1: U7.9(!LOAD) U8.9(!LOAD) U32.11(2Y1)
-LDH2: U11.9(!LOAD) U12.9(!LOAD) U32.10(2Y2)
-LDH3: U15.9(!LOAD) U16.9(!LOAD) U32.9(2Y3)
-LDH4: U40.11(4Y) U42.1(!E)
-LDHG: U32.15(!G2) U40.6(2Y)
-LDL: U30.15(Y0) U37.12(4A) U40.1(1A) U40.9(3A)
-LDL0: U32.4(1Y0) U37.1(1A)
-LDL0E: U1.9(!LOAD) U2.9(!LOAD) U37.3(1Y)
-LDL1: U5.9(!LOAD) U6.9(!LOAD) U32.5(1Y1)
-LDL2: U9.9(!LOAD) U10.9(!LOAD) U32.6(1Y2)
-LDL3: U13.9(!LOAD) U14.9(!LOAD) U32.7(1Y3)
-LDL4: U40.8(3Y) U41.1(!E)
-LDLG: U32.1(!G1) U40.3(1Y)
-LDP: U37.11(4Y) U38.4(2A) U38.5(2B)
-POE: U29.1(!G1) U29.19(!G2) U37.8(3Y) U38.1(1A) U38.2(1B)
-POEH: U31.14(Y1) U35.3(2A) U37.10(3B)
-POEL: U31.15(Y0) U37.9(3A)
-RES: J1.A11 U36.1(!G1) U36.19(!G2) U37.2(1B) U37.5(2B)
-SEL0: U17.1(!G1) U17.19(!G2) U18.1(!G1) U18.19(!G2) U33.15(Y0)
-SEL1: U19.1(!G1) U19.19(!G2) U20.1(!G1) U20.19(!G2) U33.14(Y1)
-SEL2: U21.1(!G1) U21.19(!G2) U22.1(!G1) U22.19(!G2) U33.13(Y2)
-SEL3: U23.1(!G1) U23.19(!G2) U24.1(!G1) U24.19(!G2) U33.12(Y3)
-SEL4: U33.11(Y4) U40.10(3B) U40.13(4B) U43.1(!G1) U43.19(!G2) U44.1(!G1) U44.19(!G2)
A0: J1.C3 U25.18(Y1)
A1: J1.C4 U25.16(Y2)
A2: J1.C5 U25.14(Y3)
A3: J1.C6 U25.12(Y4)
A4: J1.C7 U25.9(Y5)
A5: J1.C8 U25.7(Y6)
A6: J1.C9 U25.5(Y7)
A7: J1.C10 U25.3(Y8)
A8: J1.C11 U26.18(Y1)
A9: J1.C12 U26.16(Y2)
A10: J1.C13 U26.14(Y3)
A11: J1.C14 U26.12(Y4)
A12: J1.C15 U26.9(Y5)
A13: J1.C16 U26.7(Y6)
A14: J1.C17 U26.5(Y7)
A15: J1.C18 U26.3(Y8)
CLK: J1.A24 U1.2(CLK) U2.2(CLK) U3.2(CLK) U4.2(CLK) U5.2(CLK) U6.2(CLK) U7.2(CLK) U8.2(CLK) U9.2(CLK) U10.2(CLK) U11.2(CLK) U12.2(CLK) U13.2(CLK) U14.2(CLK) U15.2(CLK) U16.2(CLK) U41.11(CLK) U42.11(CLK)
CNTN: U34.1(1Y) U39.1(!G1)
D0: J1.A3 U1.3(A) U3.3(A) U5.3(A) U7.3(A) U9.3(A) U11.3(A) U13.3(A) U15.3(A) U29.18(Y1) U36.18(Y1) U41.3(D1) U42.3(D1)
D1: J1.A4 U1.4(B) U3.4(B) U5.4(B) U7.4(B) U9.4(B) U11.4(B) U13.4(B) U15.4(B) U29.16(Y2) U36.16(Y2) U41.4(D2) U42.4(D2)
D2: J1.A5 U1.5(C) U3.5(C) U5.5(C) U7.5(C) U9.5(C) U11.5(C) U13.5(C) U15.5(C) U29.14(Y3) U36.14(Y3) U41.7(D3) U42.7(D3)
D3: J1.A6 U1.6(D) U3.6(D) U5.6(D) U7.6(D) U9.6(D) U11.6(D) U13.6(D) U15.6(D) U29.12(Y4) U36.12(Y4) U41.8(D4) U42.8(D4)
D4: J1.A7 U2.3(A) U4.3(A) U6.3(A) U8.3(A) U10.3(A) U12.3(A) U14.3(A) U16.3(A) U29.9(Y5) U36.9(Y5) U41.13(D5) U42.13(D5)
D5: J1.A8 U2.4(B) U4.4(B) U6.4(B) U8.4(B) U10.4(B) U12.4(B) U14.4(B) U16.4(B) U29.7(Y6) U36.7(Y6) U41.14(D6) U42.14(D6)
D6: J1.A9 U2.5(C) U4.5(C) U6.5(C) U8.5(C) U10.5(C) U12.5(C) U14.5(C) U16.5(C) U29.5(Y7) U36.5(Y7) U41.17(D7) U42.17(D7)
D7: J1.A10 U2.6(D) U4.6(D) U6.6(D) U8.6(D) U10.6(D) U12.6(D) U14.6(D) U16.6(D) U29.3(Y8) U36.3(Y8) U41.18(D8) U42.18(D8)
DLD0: J1.A16 U30.1(A)
DLD1: J1.A17 U30.2(B)
DLD2: J1.A18 U30.3(C)
DLD3: J1.A19 U30.6(G1)
DOE0: J1.A12 U31.1(A)
DOE1: J1.A13 U31.2(B)
DOE2: J1.A14 U31.3(C)
DOE3: J1.A15 U31.6(G1)
GND: CD1.2 CD2.2 CD3.2 CD4.2 CD5.2 CD6.2 CD7.2 CD8.2 CD9.2 CD10.2 CD11.2 CD12.2 CD13.2 CD14.2 CD15.2 CD16.2 CD17.2 CD18.2 CD19.2 CD20.2 CD21.2 CD22.2 CD23.2 CD24.2 CD25.2 CD26.2 CD27.2 CD28.2 CD29.2 CD30.2 CD31.2 CD32.2 CD33.2 CD34.2 CD35.2 CD36.2 CD37.2 CD38.2 CD39.2 CD40.2 CD41.2 CD42.2 CD43.2 CD44.2 J1.A31 J1.A32 J1.B3 J1.B5 J1.B7 J1.B9 J1.B11 J1.B13 J1.B15 J1.B17 J1.B19 J1.B21 J1.B23 J1.B25 J1.B31 J1.B32 J1.C31 J1.C32 LED3.1(K) U1.8(GND) U2.8(GND) U3.8(GND) U4.8(GND) U5.8(GND) U6.8(GND) U7.8(GND) U8.8(GND) U9.8(GND) U10.8(GND) U11.8(GND) U12.8(GND) U13.8(GND) U14.8(GND) U15.8(GND) U16.8(GND) U17.10(GND) U18.10(GND) U19.10(GND) U20.10(GND) U21.10(GND) U22.10(GND) U23.10(GND) U24.10(GND) U25.1(!G1) U25.10(GND) U25.19(!G2) U26.1(!G1) U26.10(GND) U26.19(!G2) U27.8(GND) U27.15(!OE) U28.8(GND) U28.15(!OE) U29.10(GND) U30.4(!G2A) U30.5(!G2B) U30.8(GND) U31.4(!G2A) U31.5(!G2B) U31.8(GND) U32.8(GND) U33.4(!G2A) U33.5(!G2B) U33.8(GND) U34.5(2A) U34.6(2B) U34.7(GND) U34.8(3A) U34.9(3B) U34.11(4A) U34.12(4B) U35.5(3A) U35.7(GND) U35.9(4A) U35.11(5A) U35.13(6A) U36.2(A1) U36.4(A2) U36.6(A3) U36.8(A4) U36.10(GND) U36.11(A5) U36.13(A6) U36.15(A7) U36.17(A8) U37.7(GND) U38.7(GND) U38.9(3A) U38.10(3B) U38.12(4A) U38.13(4B) U39.8(GND) U39.13(B2) U39.14(A2) U40.7(GND) U41.10(GND) U42.10(GND) U43.10(GND) U44.10(GND)
LDK: LED5.1(K) U38.6(2Y)
LEDLD: LED5.2(A) R5.2
LEDP: LED3.2(A) RP1.2
LEDRD: LED4.2(A) R4.2
PB0: U17.18(Y1) U19.18(Y1) U21.18(Y1) U23.18(Y1) U25.2(A1) U27.2(A1) U43.18(Y1)
PB1: U17.16(Y2) U19.16(Y2) U21.16(Y2) U23.16(Y2) U25.4(A2) U27.5(A2) U43.16(Y2)
PB2: U17.14(Y3) U19.14(Y3) U21.14(Y3) U23.14(Y3) U25.6(A3) U27.11(A3) U43.14(Y3)
PB3: U17.12(Y4) U19.12(Y4) U21.12(Y4) U23.12(Y4) U25.8(A4) U27.14(A4) U43.12(Y4)
PB4: U17.9(Y5) U19.9(Y5) U21.9(Y5) U23.9(Y5) U25.11(A5) U28.2(A1) U43.9(Y5)
PB5: U17.7(Y6) U19.7(Y6) U21.7(Y6) U23.7(Y6) U25.13(A6) U28.5(A2) U43.7(Y6)
PB6: U17.5(Y7) U19.5(Y7) U21.5(Y7) U23.5(Y7) U25.15(A7) U28.11(A3) U43.5(Y7)
PB7: U17.3(Y8) U19.3(Y8) U21.3(Y8) U23.3(Y8) U25.17(A8) U28.14(A4) U43.3(Y8)
PB8: U18.18(Y1) U20.18(Y1) U22.18(Y1) U24.18(Y1) U26.2(A1) U27.3(B1) U44.18(Y1)
PB9: U18.16(Y2) U20.16(Y2) U22.16(Y2) U24.16(Y2) U26.4(A2) U27.6(B2) U44.16(Y2)
PB10: U18.14(Y3) U20.14(Y3) U22.14(Y3) U24.14(Y3) U26.6(A3) U27.10(B3) U44.14(Y3)
PB11: U18.12(Y4) U20.12(Y4) U22.12(Y4) U24.12(Y4) U26.8(A4) U27.13(B4) U44.12(Y4)
PB12: U18.9(Y5) U20.9(Y5) U22.9(Y5) U24.9(Y5) U26.11(A5) U28.3(B1) U44.9(Y5)
PB13: U18.7(Y6) U20.7(Y6) U22.7(Y6) U24.7(Y6) U26.13(A6) U28.6(B2) U44.7(Y6)
PB14: U18.5(Y7) U20.5(Y7) U22.5(Y7) U24.5(Y7) U26.15(A7) U28.10(B3) U44.5(Y7)
PB15: U18.3(Y8) U20.3(Y8) U22.3(Y8) U24.3(Y8) U26.17(A8) U28.13(B4) U44.3(Y8)
PDEC: J1.A23 U34.3(1B) U35.1(1A)
PINC: J1.A22 U34.2(1A)
POEHP: U27.1(S) U28.1(S) U35.4(2Y)
PQ0_0: U1.14(QA) U17.2(A1)
PQ0_1: U1.13(QB) U17.4(A2)
PQ0_2: U1.12(QC) U17.6(A3)
PQ0_3: U1.11(QD) U17.8(A4)
PQ0_4: U2.14(QA) U17.11(A5)
PQ0_5: U2.13(QB) U17.13(A6)
PQ0_6: U2.12(QC) U17.15(A7)
PQ0_7: U2.11(QD) U17.17(A8)
PQ0_8: U3.14(QA) U18.2(A1)
PQ0_9: U3.13(QB) U18.4(A2)
PQ0_10: U3.12(QC) U18.6(A3)
PQ0_11: U3.11(QD) U18.8(A4)
PQ0_12: U4.14(QA) U18.11(A5)
PQ0_13: U4.13(QB) U18.13(A6)
PQ0_14: U4.12(QC) U18.15(A7)
PQ0_15: U4.11(QD) U18.17(A8)
PQ1_0: U5.14(QA) U19.2(A1)
PQ1_1: U5.13(QB) U19.4(A2)
PQ1_2: U5.12(QC) U19.6(A3)
PQ1_3: U5.11(QD) U19.8(A4)
PQ1_4: U6.14(QA) U19.11(A5)
PQ1_5: U6.13(QB) U19.13(A6)
PQ1_6: U6.12(QC) U19.15(A7)
PQ1_7: U6.11(QD) U19.17(A8)
PQ1_8: U7.14(QA) U20.2(A1)
PQ1_9: U7.13(QB) U20.4(A2)
PQ1_10: U7.12(QC) U20.6(A3)
PQ1_11: U7.11(QD) U20.8(A4)
PQ1_12: U8.14(QA) U20.11(A5)
PQ1_13: U8.13(QB) U20.13(A6)
PQ1_14: U8.12(QC) U20.15(A7)
PQ1_15: U8.11(QD) U20.17(A8)
PQ2_0: U9.14(QA) U21.2(A1)
PQ2_1: U9.13(QB) U21.4(A2)
PQ2_2: U9.12(QC) U21.6(A3)
PQ2_3: U9.11(QD) U21.8(A4)
PQ2_4: U10.14(QA) U21.11(A5)
PQ2_5: U10.13(QB) U21.13(A6)
PQ2_6: U10.12(QC) U21.15(A7)
PQ2_7: U10.11(QD) U21.17(A8)
PQ2_8: U11.14(QA) U22.2(A1)
PQ2_9: U11.13(QB) U22.4(A2)
PQ2_10: U11.12(QC) U22.6(A3)
PQ2_11: U11.11(QD) U22.8(A4)
PQ2_12: U12.14(QA) U22.11(A5)
PQ2_13: U12.13(QB) U22.13(A6)
PQ2_14: U12.12(QC) U22.15(A7)
PQ2_15: U12.11(QD) U22.17(A8)
PQ3_0: U13.14(QA) U23.2(A1)
PQ3_1: U13.13(QB) U23.4(A2)
PQ3_2: U13.12(QC) U23.6(A3)
PQ3_3: U13.11(QD) U23.8(A4)
PQ3_4: U14.14(QA) U23.11(A5)
PQ3_5: U14.13(QB) U23.13(A6)
PQ3_6: U14.12(QC) U23.15(A7)
PQ3_7: U14.11(QD) U23.17(A8)
PQ3_8: U15.14(QA) U24.2(A1)
PQ3_9: U15.13(QB) U24.4(A2)
PQ3_10: U15.12(QC) U24.6(A3)
PQ3_11: U15.11(QD) U24.8(A4)
PQ3_12: U16.14(QA) U24.11(A5)
PQ3_13: U16.13(QB) U24.13(A6)
PQ3_14: U16.12(QC) U24.15(A7)
PQ3_15: U16.11(QD) U24.17(A8)
PSEL0: J1.A20 U32.2(A1) U32.14(A2) U33.1(A) U39.2(A1)
PSEL1: J1.A21 U32.3(B1) U32.13(B2) U33.2(B) U39.3(B1)
PSEL2: J1.C27 U33.3(C) U40.2(1B) U40.5(2B)
PTQ0_0: U41.2(Q1) U43.2(A1)
PTQ0_1: U41.5(Q2) U43.4(A2)
PTQ0_2: U41.6(Q3) U43.6(A3)
PTQ0_3: U41.9(Q4) U43.8(A4)
PTQ0_4: U41.12(Q5) U43.11(A5)
PTQ0_5: U41.15(Q6) U43.13(A6)
PTQ0_6: U41.16(Q7) U43.15(A7)
PTQ0_7: U41.19(Q8) U43.17(A8)
PTQ1_0: U42.2(Q1) U44.2(A1)
PTQ1_1: U42.5(Q2) U44.4(A2)
PTQ1_2: U42.6(Q3) U44.6(A3)
PTQ1_3: U42.9(Q4) U44.8(A4)
PTQ1_4: U42.12(Q5) U44.11(A5)
PTQ1_5: U42.15(Q6) U44.13(A6)
PTQ1_6: U42.16(Q7) U44.15(A7)
PTQ1_7: U42.19(Q8) U44.17(A8)
RB0: U27.4(Y1) U29.2(A1)
RB1: U27.7(Y2) U29.4(A2)
RB2: U27.9(Y3) U29.6(A3)
RB3: U27.12(Y4) U29.8(A4)
RB4: U28.4(Y1) U29.11(A5)
RB5: U28.7(Y2) U29.13(A6)
RB6: U28.9(Y3) U29.15(A7)
RB7: U28.12(Y4) U29.17(A8)
RC0_0: U1.15(!RCO) U2.10(!ENT)
RC0_1: U2.15(!RCO) U3.10(!ENT)
RC0_2: U3.15(!RCO) U4.10(!ENT)
RC1_0: U5.15(!RCO) U6.10(!ENT)
RC1_1: U6.15(!RCO) U7.10(!ENT)
RC1_2: U7.15(!RCO) U8.10(!ENT)
RC2_0: U9.15(!RCO) U10.10(!ENT)
RC2_1: U10.15(!RCO) U11.10(!ENT)
RC2_2: U11.15(!RCO) U12.10(!ENT)
RC3_0: U13.15(!RCO) U14.10(!ENT)
RC3_1: U14.15(!RCO) U15.10(!ENT)
RC3_2: U15.15(!RCO) U16.10(!ENT)
RDK: LED4.1(K) U38.3(1Y)
UDB: U1.1(UD) U2.1(UD) U3.1(UD) U4.1(UD) U5.1(UD) U6.1(UD) U7.1(UD) U8.1(UD) U9.1(UD) U10.1(UD) U11.1(UD) U12.1(UD) U13.1(UD) U14.1(UD) U15.1(UD) U16.1(UD) U35.2(1Y)
VCC: CD1.1 CD2.1 CD3.1 CD4.1 CD5.1 CD6.1 CD7.1 CD8.1 CD9.1 CD10.1 CD11.1 CD12.1 CD13.1 CD14.1 CD15.1 CD16.1 CD17.1 CD18.1 CD19.1 CD20.1 CD21.1 CD22.1 CD23.1 CD24.1 CD25.1 CD26.1 CD27.1 CD28.1 CD29.1 CD30.1 CD31.1 CD32.1 CD33.1 CD34.1 CD35.1 CD36.1 CD37.1 CD38.1 CD39.1 CD40.1 CD41.1 CD42.1 CD43.1 CD44.1 J1.A1 J1.A2 J1.B1 J1.B2 J1.C1 J1.C2 R4.1 R5.1 RP1.1 U1.16(VCC) U2.16(VCC) U3.16(VCC) U4.16(VCC) U5.16(VCC) U6.16(VCC) U7.16(VCC) U8.16(VCC) U9.16(VCC) U10.16(VCC) U11.16(VCC) U12.16(VCC) U13.16(VCC) U14.16(VCC) U15.16(VCC) U16.16(VCC) U17.20(VCC) U18.20(VCC) U19.20(VCC) U20.20(VCC) U21.20(VCC) U22.20(VCC) U23.20(VCC) U24.20(VCC) U25.20(VCC) U26.20(VCC) U27.16(VCC) U28.16(VCC) U29.20(VCC) U30.16(VCC) U31.16(VCC) U32.16(VCC) U33.6(G1) U33.16(VCC) U34.14(VCC) U35.14(VCC) U36.20(VCC) U37.14(VCC) U38.14(VCC) U39.15(!G2) U39.16(VCC) U40.14(VCC) U41.20(VCC) U42.20(VCC) U43.20(VCC) U44.20(VCC)
Unconnected: J1.A25 J1.A26 J1.A27 J1.A28 J1.A29 J1.A30 J1.B4 J1.B6 J1.B8 J1.B10 J1.B12 J1.B14 J1.B16 J1.B18 J1.B20 J1.B22 J1.B24 J1.B26 J1.B27 J1.B28 J1.B29 J1.B30 J1.C19 J1.C20 J1.C21 J1.C22 J1.C23 J1.C24 J1.C25 J1.C26 J1.C28 J1.C29 J1.C30 U4.15(!RCO) U8.15(!RCO) U12.15(!RCO) U16.15(!RCO) U30.7(Y7) U30.9(Y6) U30.10(Y5) U30.11(Y4) U30.12(Y3) U30.13(Y2) U31.7(Y7) U31.9(Y6) U31.10(Y5) U31.11(Y4) U31.12(Y3) U31.13(Y2) U33.7(Y7) U33.9(Y6) U33.10(Y5) U34.4(2Y) U34.10(3Y) U34.13(4Y) U35.6(3Y) U35.8(4Y) U35.10(5Y) U35.12(6Y) U38.8(3Y) U38.11(4Y) U39.9(2Y3) U39.10(2Y2) U39.11(2Y1) U39.12(2Y0)

## Notes on the sheet
- P0 L0 | P0 L1 | P0 H0 | P0 H1
- 74HCT169 | 74HCT169 | 74HCT169 | 74HCT169
- P8X REGISTER BANK CARD REV B (P0=PC P3=SP, PT scratch)
- P1 L0 | P1 L1 | P1 H0 | P1 H1
- 74HCT169 | 74HCT169 | 74HCT169 | 74HCT169
- P2 L0 | P2 L1 | P2 H0 | P2 H1
- 74HCT169 | 74HCT169 | 74HCT169 | 74HCT169
- P3 L0 | P3 L1 | P3 H0 | P3 H1
- 74HCT169 | 74HCT169 | 74HCT169 | 74HCT169
- PTR SEL 0 | PTR SEL 1 | PTR SEL 2 | PTR SEL 3
- 74HCT244 | 74HCT244 | 74HCT244 | 74HCT244
- PTR SEL 4 | PTR SEL 5 | PTR SEL 6 | PTR SEL 7
- 74HCT244 | 74HCT244 | 74HCT244 | 74HCT244
- ADDR LO | ADDR HI | RDBK LO | RDBK HI
- 74HCT244 | 74HCT244 | 74HCT257 | 74HCT257
- RDBK OUT | DLD DEC | DOE DEC | LOAD DEC
- 74HCT244 | 74HCT138 | 74HCT138 | 74HCT139
- SEL DEC | ZERO P0
- 74HCT138 | 74HCT244
- CNT DEC
- 74HCT139
- PT LO | PT HI | PT SEL LO | PT SEL HI
- 74HCT377 | 74HCT377 | 74HCT244 | 74HCT244
- PWR | RD
- GRN | GRN
- LD
- YEL

## Library data of the parts
CD1-CD44 = p8x:CAP1
J1 = p8x:DIN96C
LED3-LED5 = p8x:LED
R4 R5 RP1 = p8x:RES
U1-U16 = p8x:74169
U17-U26 U29 U36 U43 U44 = p8x:74244
U27 U28 = p8x:74257
U30 U31 U33 = p8x:74138
U32 U39 = p8x:74139
U34 = p8x:7402
U35 = p8x:HEX14
U37 U38 U40 = p8x:GATES14
U41 U42 = p8x:74377V2